# Altium project Timingcard_PROJECT_v10.PrjPcb (part 2 of 4)

## Sheet 05-GPS_IMU_SENSORS.SchDoc
size Tabloid; Customer: 01910; SPICEModelCache: <root> / <DocumentId>YSTRYKDD</DocumentId> / <CacheFrame Number="0"> / <Model Name="emk105bj105_v-f" Kind="CKT"> / <Text>* EMK105BJ105_V-F     SPICE MODEL  ( General Type ) / *-------------------------------------------------------------------------------------------------------- / * Model Generated by TAIYO YUDEN Corporation (http://www.ty-top.com) / * Version 1.0 / * TAIYO YUDEN Control No. 170508_130520 / * Copyright(c) 2012 TAIYO YUDEN CO.,LTD. All Rights Reserved. / *-------------------------------------------------------------------------------------------------------- / * / * Products Name : Multilayer Ceramic Capacitors / * / * Characteristics : / *     Capacitance : 1 uF , Rated Voltage : 16V , TCC : X5R / *     Case Size : 1.0 x 0.5 / 0.039 x 0.02 [mm/inch] , Thickness : 0.5 / 0.02 [mm/inch] / *     (Conditions: Temperature = 25 degC , DC Bias Current/Voltage = 0A / 0V) / * / * Frequency Range : 40Hz - 3GHz / * / * External Node Assignments : / * / *  1  o---| |---o  2 / * / *-------------------------------------------------------------------------------------------------------- / .SubCkt EMK105BJ105_V-F 1 2 / **************************** / C0 1 110 0.68309u / Cm 1 101 0.26053u / C1 101 102 0.94076u / Rc1 101 102 1.9029k / C2 102 103 0.66707u / Rc2 102 103 120.36 / C3 103 110 0.57203u / Rc3 103 110 2.1097 / C2m 1 301 0.1871u / C21 301 302 3.2494u / Rc21 301 302 1.1117k / C22 302 303 2.1014u / Rc22 302 303 1.484k / C23 303 304 2.1172u / Rc23 303 304 1.3876k / C24 304 305 0.75729u / Rc24 304 305 332.59 / C25 305 306 0.94401u / Rc25 305 306 249.09 / C26 306 307 0.34674u / Rc26 306 307 28.352 / C27 307 308 0.37158u / Rc27 307 308 19.989 / C28 308 309 0.17933u / Rc28 308 309 31.748 / C29 309 110 0.016445u / Rc29 309 110 1.0592 / Rp0 1 110 100Meg / L0 110 120 0.2216n / Lm 120 130 0.1509n / L1 120 121 0.12659n / RL1 121 130 0.85161 / L2 120 122 0.15996n / RL2 122 130 0.42469 / L3 120 123 7.9543n / RL3 123 130 0.54643m / CR 120 124 0.24334u / LR 124 125 0.090738n / RR 125 130 68.076m / CL 130 140 2.7354p / LL 130 140 0.10762n / RL 130 140 50.614 / Rs 140 2 7.5416m / **************************** / .ends EMK105BJ105_V-F</Text> / </Model> / </CacheFrame> / </root>; SheetNumber: 5; SheetTotal: 16
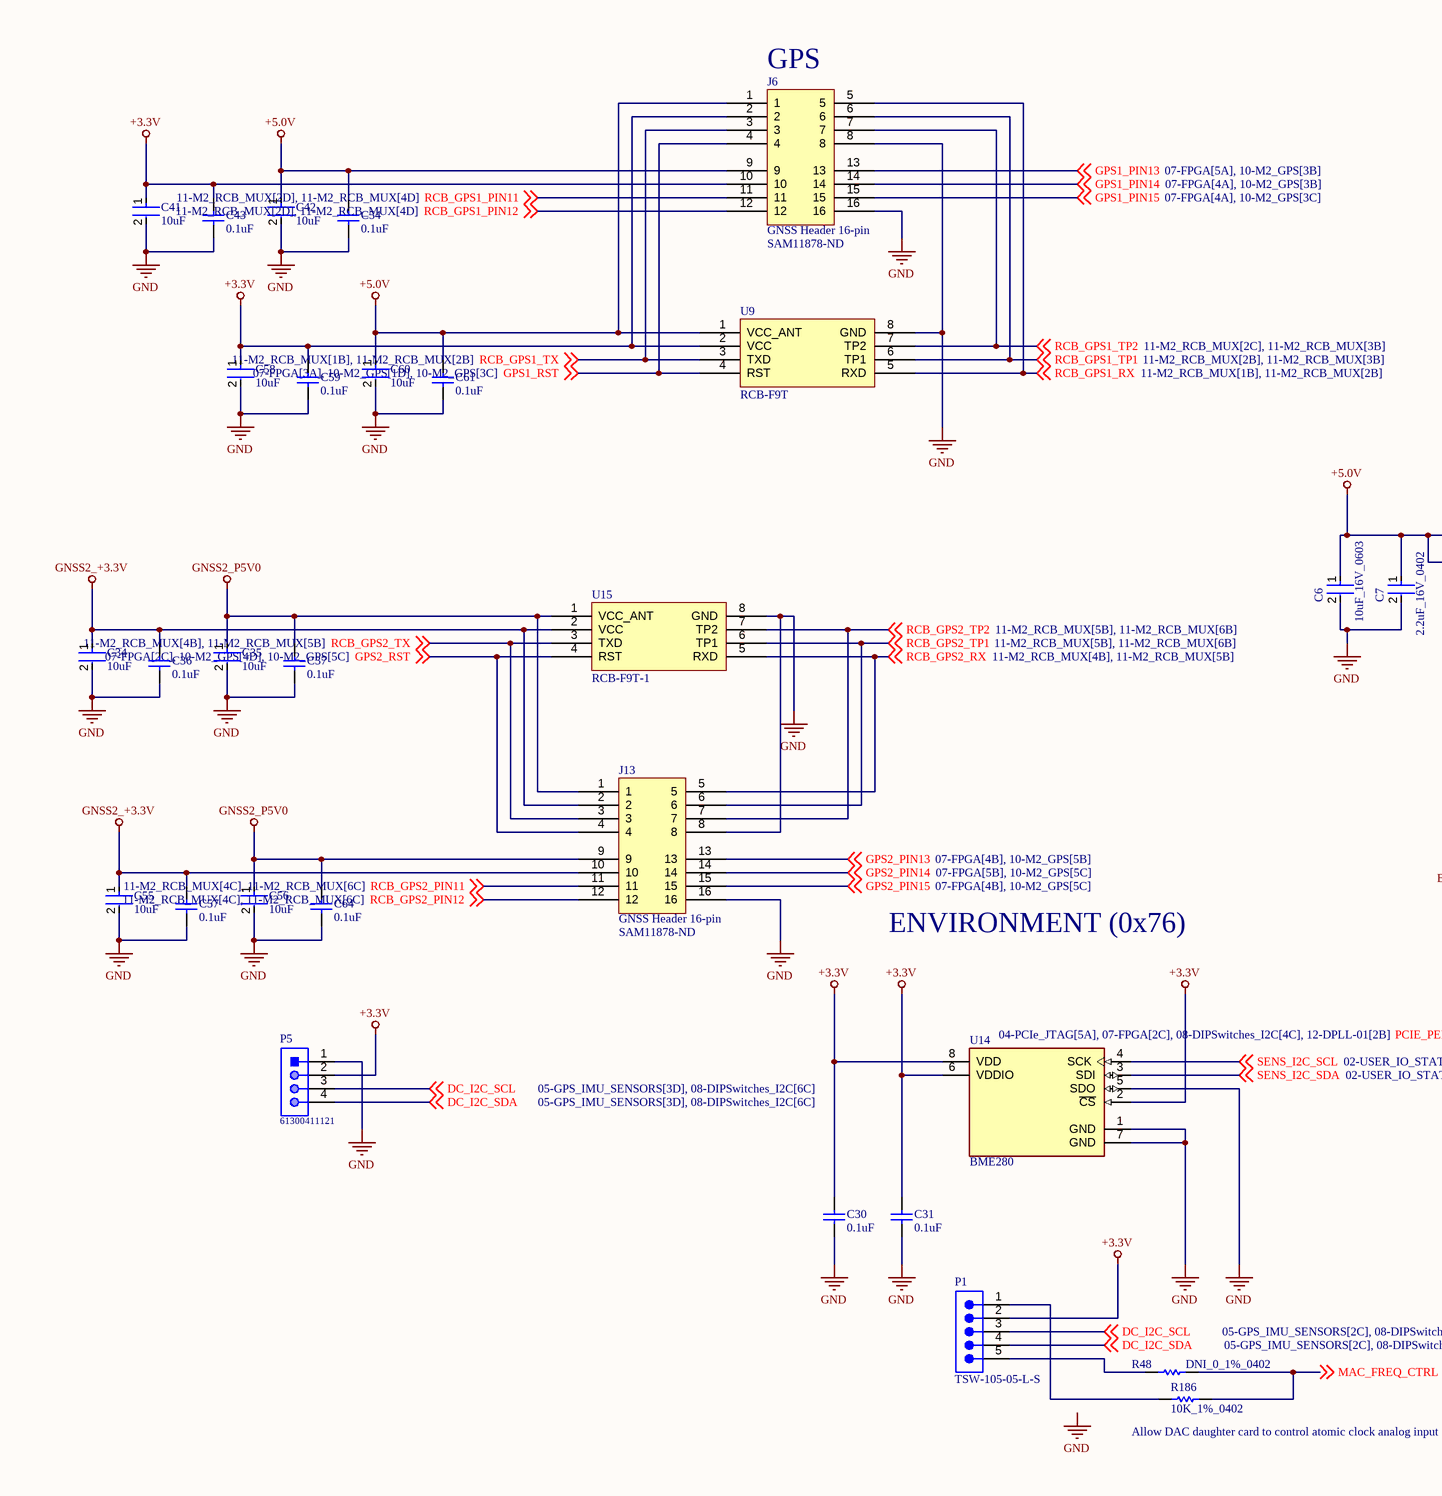
[diagram p4: 05-GPS_IMU_SENSORS.SchDoc, left]
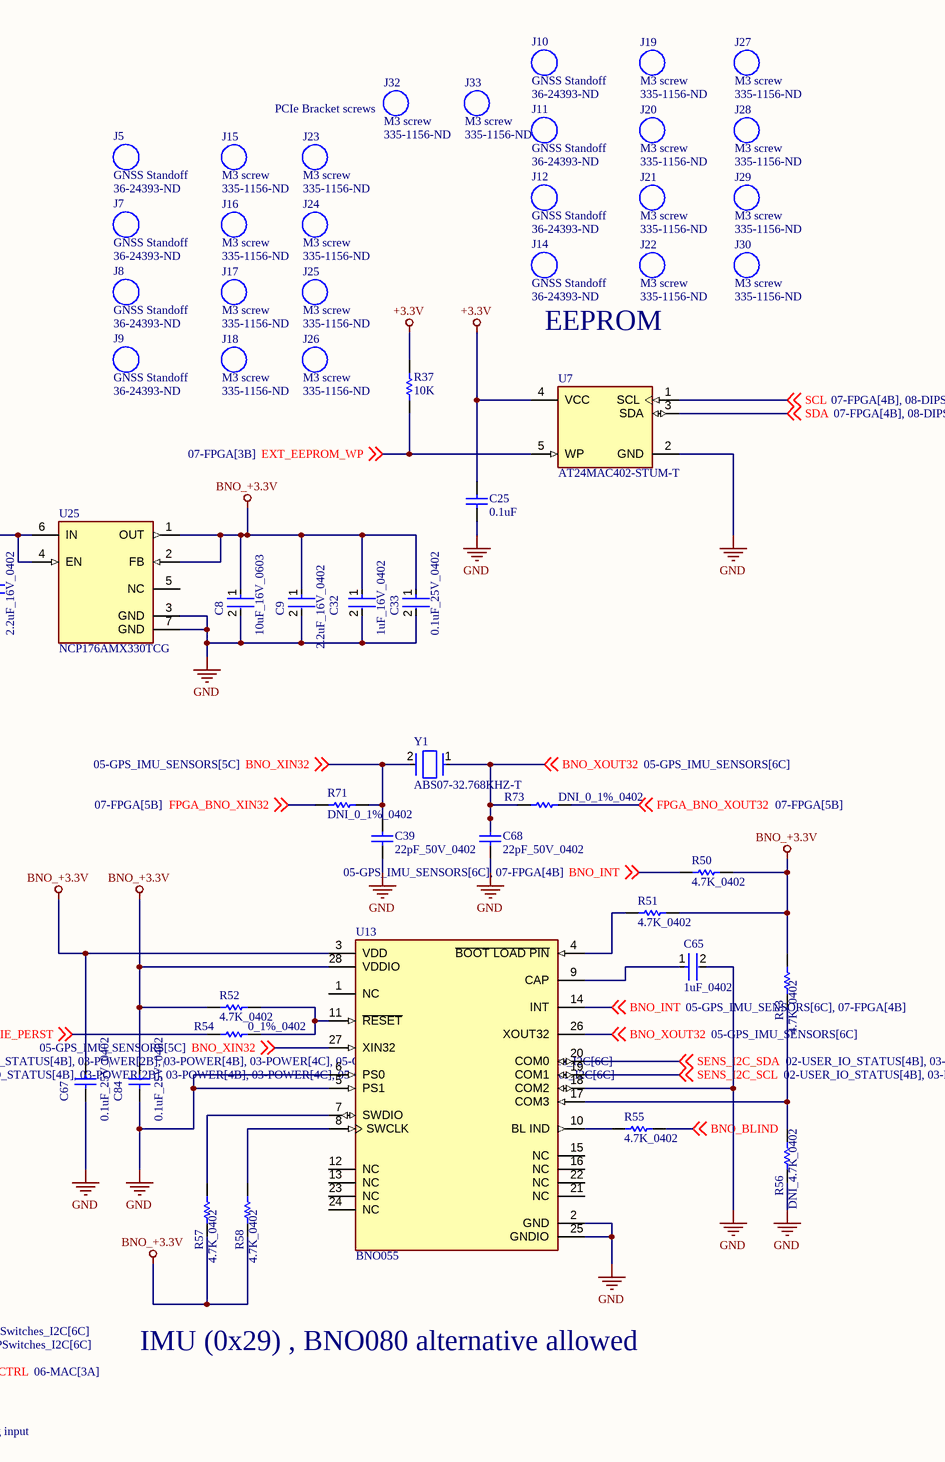
[diagram p5: 05-GPS_IMU_SENSORS.SchDoc, right]

### Parts
C6  10uF_16V_0603  [FP-0603-L_1_6_0_2-W_0_8_0-MFG]
C7  2.2uF_16V_0402  [FP-C1005-050-0_05-IPC_A]
C8  10uF_16V_0603  [FP-0603-L_1_6_0_2-W_0_8_0-MFG]
C9  2.2uF_16V_0402  [FP-C1005-050-0_05-IPC_A]
C25  0.1uF  [CAPC1608X87X45ML20T05]
C30  0.1uF  [CAPC1608X87X45ML20T05]
C31  0.1uF  [CAPC1608X87X45ML20T05]
C32  1uF_16V_0402  [FP-0402-L_1_0_0_05-W_0_5-IPC_A]
C33  0.1uF_25V_0402  [FP-0402-L_1_0_1-W_0_5_0_1-IPC_C]
C34  10uF  [FP-MK212BG-MFG]
C35  10uF  [FP-MK212BG-MFG]
C36  0.1uF  [CAPC1608X87X45ML20T05]
C37  0.1uF  [CAPC1608X87X45ML20T05]
C39  22pF_50V_0402  [CAPC1005X55X25ML05T05]
C41  10uF  [FP-MK212BG-MFG]
C42  10uF  [FP-MK212BG-MFG]
C43  0.1uF  [CAPC1608X87X45ML20T05]
C54  0.1uF  [CAPC1608X87X45ML20T05]
C55  10uF  [FP-MK212BG-MFG]
C56  10uF  [FP-MK212BG-MFG]
C57  0.1uF  [CAPC1608X87X45ML20T05]
C58  10uF  [FP-MK212BG-MFG]
C59  0.1uF  [CAPC1608X87X45ML20T05]
C60  10uF  [FP-MK212BG-MFG]
C61  0.1uF  [CAPC1608X87X45ML20T05]
C64  0.1uF  [CAPC1608X87X45ML20T05]
C65  1uF_0402  [FP-0402-L_1_0_0_05-W_0_5-IPC_C]
C67  0.1uF_25V_0402  [CAPC1005X56X25NL10T15]
C68  22pF_50V_0402  [CAPC1005X55X25ML05T05]
C84  0.1uF_25V_0402  [CAPC1005X56X25NL10T15]
J5  GNSS Standoff  Supplier Part Number 1: 36-24393-ND
J6  GNSS Header 16-pin  Supplier Part Number 1: SAM11878-ND  [GNSS Header 16-pin]
J7  GNSS Standoff  Supplier Part Number 1: 36-24393-ND
J8  GNSS Standoff  Supplier Part Number 1: 36-24393-ND
J9  GNSS Standoff  Supplier Part Number 1: 36-24393-ND
J10  GNSS Standoff  Supplier Part Number 1: 36-24393-ND
J11  GNSS Standoff  Supplier Part Number 1: 36-24393-ND
J12  GNSS Standoff  Supplier Part Number 1: 36-24393-ND
J13  GNSS Header 16-pin  Supplier Part Number 1: SAM11878-ND  [GNSS Header 16-pin]
J14  GNSS Standoff  Supplier Part Number 1: 36-24393-ND
J15  M3 screw  Supplier Part Number 1: 335-1156-ND
J16  M3 screw  Supplier Part Number 1: 335-1156-ND
J17  M3 screw  Supplier Part Number 1: 335-1156-ND
J18  M3 screw  Supplier Part Number 1: 335-1156-ND
J19  M3 screw  Supplier Part Number 1: 335-1156-ND
J20  M3 screw  Supplier Part Number 1: 335-1156-ND
J21  M3 screw  Supplier Part Number 1: 335-1156-ND
J22  M3 screw  Supplier Part Number 1: 335-1156-ND
J23  M3 screw  Supplier Part Number 1: 335-1156-ND
J24  M3 screw  Supplier Part Number 1: 335-1156-ND
J25  M3 screw  Supplier Part Number 1: 335-1156-ND
J26  M3 screw  Supplier Part Number 1: 335-1156-ND
J27  M3 screw  Supplier Part Number 1: 335-1156-ND
J28  M3 screw  Supplier Part Number 1: 335-1156-ND
J29  M3 screw  Supplier Part Number 1: 335-1156-ND
J30  M3 screw  Supplier Part Number 1: 335-1156-ND
J32  M3 screw  Supplier Part Number 1: 335-1156-ND
J33  M3 screw  Supplier Part Number 1: 335-1156-ND
P1  TSW-105-05-L-S  [SMTC-TSW-105-05-X-S]
P5  61300411121  [61300411121]
R37  10K  [RESC1608X55X30LL15T20]
R48  DNI_0_1%_0402  [RESC1005X40X25LL05T05]  (no BOM)
R50  4.7K_0402  [RESC1005X40X25LL05T05]
R51  4.7K_0402  [RESC1005X40X25LL05T05]
R52  4.7K_0402  [RESC1005X40X25LL05T05]
R53  4.7K_0402  [RESC1005X40X25LL05T05]
R54  0_1%_0402  [RESC1005X40X25LL05T05]
R55  4.7K_0402  [RESC1005X40X25LL05T05]
R56  DNI_4.7K_0402  [RESC1005X40X25LL05T05]  (no BOM)
R57  4.7K_0402  [RESC1005X40X25LL05T05]
R58  4.7K_0402  [RESC1005X40X25LL05T05]
R71  DNI_0_1%_0402  [RESC1005X40X25LL05T05]  (no BOM)
R73  DNI_0_1%_0402  [RESC1005X40X25LL05T05]  (no BOM)
R186  10K_1%_0402  [RESC1005X40X25LL05T10]
U7  AT24MAC402-STUM-T  [FP-5TS1-IPC_C]
U9  RCB-F9T  [GNSS]
U13  BNO055  [FP-BNO055-MFG]
U14  BME280  [FP-BME280-MFG]
U15  RCB-F9T-1  [GNSS]
U25  NCP176AMX330TCG  [FP-711AT-MFG]
Y1  ABS07-32.768KHZ-T  [FP-ABS07-MFG]

### Nets
+3.3V: C25.2 C30.2 C31.2 C41.1 C43.2 C58.1 C59.2 J6.2 J6.10 P1.2 P5.2 R37.2 U7.4(VCC) U9.2(VCC) U14.2(~{CS}) U14.6(VDDIO) U14.8(VDD)
+5.0V: C6.1 C7.1 C42.1 C54.2 C60.1 C61.2 J6.1 J6.9 U9.1(VCC_ANT) U25.4(EN) U25.6(IN)
BNO_+3.3V: C8.1 C9.1 C32.1 C33.1 C67.2 C84.2 R50.1 R51.1 R52.2 R53.2 R57.1 R58.1 U13.3(VDD) U13.28(VDDIO) U25.1(OUT) U25.2(FB)
GND: C6.2 C7.2 C8.2 C9.2 C25.1 C30.1 C31.1 C32.2 C33.2 C34.2 C35.2 C36.1 C37.1 C39.1 C41.2 C42.2 C43.1 C54.1 C55.2 C56.2 C57.1 C58.2 C59.1 C60.2 C61.1 C64.1 C65.2 C67.1 C68.1 C84.1 J6.8 J6.16 J13.8 J13.16 P5.1 R56.1 U7.2(GND) U9.8(GND) U13.2(GND) U13.5(PS1) U13.6(PS0) U13.18(COM2) U13.25(GNDIO) U14.1(GND) U14.5(SDO) U14.7(GND) U15.8(GND) U25.3(GND) U25.7(GND)
GNSS2_+3.3V: C34.1 C36.2 C55.1 C57.2 J13.2 J13.10 U15.2(VCC)
GNSS2_P5V0: C35.1 C37.2 C56.1 C64.2 J13.1 J13.9 U15.1(VCC_ANT)
BNO_BLIND: R55.1 ; off-sheet BNO_BLIND
BNO_INT: R50.2 U13.14(INT) ; off-sheet BNO_INT
BNO_XIN32: C39.2 R71.1 U13.27(XIN32) Y1.2 ; off-sheet BNO_XIN32
BNO_XOUT32: C68.2 R73.1 U13.26(XOUT32) Y1.1 ; off-sheet BNO_XOUT32
DC_I2C_SCL: P1.3 P5.3 ; off-sheet DC_I2C_SCL
DC_I2C_SDA: P1.4 P5.4 ; off-sheet DC_I2C_SDA
EXT_EEPROM_WP: R37.1 U7.5(WP) ; off-sheet EXT_EEPROM_WP
FPGA_BNO_XIN32: R71.2 ; off-sheet FPGA_BNO_XIN32
FPGA_BNO_XOUT32: R73.2 ; off-sheet FPGA_BNO_XOUT32
GPS1_PIN13: J6.13 ; off-sheet GPS1_PIN13
GPS1_PIN14: J6.14 ; off-sheet GPS1_PIN14
GPS1_PIN15: J6.15 ; off-sheet GPS1_PIN15
GPS1_RST: J6.4 U9.4(RST) ; off-sheet GPS1_RST
GPS2_PIN13: J13.13 ; off-sheet GPS2_PIN13
GPS2_PIN14: J13.14 ; off-sheet GPS2_PIN14
GPS2_PIN15: J13.15 ; off-sheet GPS2_PIN15
GPS2_RST: J13.4 U15.4(RST) ; off-sheet GPS2_RST
MAC_FREQ_CTRL: R48.2 R186.2 ; off-sheet MAC_FREQ_CTRL
PCIE_PERST: R54.1 ; off-sheet PCIE_PERST
RCB_GPS1_PIN11: J6.11 ; off-sheet RCB_GPS1_PIN11
RCB_GPS1_PIN12: J6.12 ; off-sheet RCB_GPS1_PIN12
RCB_GPS1_RX: J6.5 U9.5(RXD) ; off-sheet RCB_GPS1_RX
RCB_GPS1_TP1: J6.6 U9.6(TP1) ; off-sheet RCB_GPS1_TP1
RCB_GPS1_TP2: J6.7 U9.7(TP2) ; off-sheet RCB_GPS1_TP2
RCB_GPS1_TX: J6.3 U9.3(TXD) ; off-sheet RCB_GPS1_TX
RCB_GPS2_PIN11: J13.11 ; off-sheet RCB_GPS2_PIN11
RCB_GPS2_PIN12: J13.12 ; off-sheet RCB_GPS2_PIN12
RCB_GPS2_RX: J13.5 U15.5(RXD) ; off-sheet RCB_GPS2_RX
RCB_GPS2_TP1: J13.6 U15.6(TP1) ; off-sheet RCB_GPS2_TP1
RCB_GPS2_TP2: J13.7 U15.7(TP2) ; off-sheet RCB_GPS2_TP2
RCB_GPS2_TX: J13.3 U15.3(TXD) ; off-sheet RCB_GPS2_TX
SCL: U7.1(SCL) ; off-sheet SCL
SDA: U7.3(SDA) ; off-sheet SDA
SENS_I2C_SCL: U13.19(COM1) U14.4(SCK) ; off-sheet SENS_I2C_SCL
SENS_I2C_SDA: U13.20(COM0) U14.3(SDI) ; off-sheet SENS_I2C_SDA
NetC65_1: C65.1 U13.9(CAP)
NetP1_1: P1.1 R186.1
NetP1_5: P1.5 R48.1
NetR51_2: R51.2 U13.4(~{BOOT_LOAD_PIN})
NetR52_1: R52.1 R54.2 U13.11(~{RESET})
NetR53_1: R53.1 R56.2 U13.17(COM3)
NetR55_2: R55.2 U13.10(BL_IND)
NetR57_2: R57.2 U13.7(SWDIO)
NetR58_2: R58.2 U13.8(SWCLK)

Not connected (* = marked no-connect by the designer): U13 1(NC) 12(NC) 13(NC) 15(NC) 16(NC) 21(NC) 22(NC) 23(NC) 24(NC); U25 5(NC)

### Notes on the sheet
- (near J6) GPS
- (near J32) PCIe Bracket screws
- EEPROM
- ENVIRONMENT (0x76)
- IMU (0x29) , BNO080 alternative allowed
- (near R186) Allow DAC daughter card to control atomic clock analog input
- Labels drawn without touching a wire or pin: GND
- SHEET
- REV
- timingcard.com <http://timingcard.com>
- DATE
- OF

### Library data of the parts
C6 C8 = CMP-2000-06226-4: Multilayer Ceramic Capacitor 10uF 16V X5R 20% SMD 0603 T/R; Packaging: Tape and Reel; Construction: Flat; Height: 0.8mm; Max Operating Temperature: 85°C; Dielectric: X5R; Case Code (Metric): 1608; Voltage Rating (DC): 16V; Width: 0.031inch; Voltage Rating: 16V; Length: 0.063inch; RoHS Compliant: Yes; Halogen Free: Halogen Free; Case Code (Imperial): 0603; Capacitance: 10uF; Mount: Surface Mount; Thickness: 0.031inch; Tolerance: 20%; Min Operating Temperature: -55°C; Series: M; Termination: SMD/SMT; Case/Package: 0603; Package Quantity: 1
C7 C9 = CMP-2000-05998-2: Multilayer Ceramic Capacitors 2.2μF ±10% 16V X5R SMD 0402; Capacitance: 2.2uF; REACH SVHC: No SVHC; Series: C; Termination: SMD/SMT; Case Code (Imperial): 0402; Depth: 0.5mm; Mount: Surface Mount; Width: 0.02inch; Package Quantity: 1; Dielectric Material: Ceramic; Length: 1mm; Packaging: Tape and Reel; Case Code (Metric): 1005; RoHS Compliant: Yes; Dielectric: X5R; Max Operating Temperature: 85°C; Lead Free: Lead Free; Weight: 2.3E-05oz; Thickness: 0.022inch; Voltage Rating (DC): 16V; Tolerance: 10%; Voltage Rating: 16V; Resistor Type: Ceramic; Height: 0.5mm; Case/Package: 0402; Min Operating Temperature: -55°C
C25 C30 C31 C36 C37 C43 C54 C57 C59 C61 C64 = CMP-2006-00003-1: C0603X104K5RACAUTO; Manufacturer: Kemet; Part Number: C0603X104K5RACAUTO
C32 = CMP-14477-000104-2: None; Tolerance: 10%; Voltage Rating: 16V; Dielectric: X5R; Capacitance: 1uF; Packaging: Tape and Reel; Depth: 0.5mm; Mount: Surface Mount; Thickness: 0.022inch; Package Quantity: 1; Min Operating Temperature: -55°C; Series: M; Voltage Rating (DC): 16V; Termination: SMD/SMT; Case/Package: 0402; Number of Pins: 2; Case Code (Imperial): 0402; Length: 1mm; Halogen Free: Halogen Free; Case Code (Metric): 1005; Width: 0.02inch; RoHS Compliant: Yes; Radiation Hardening: No; Max Operating Temperature: 85°C; Height: 0.5mm; Construction: Flat
C33 = CMP-2008-02519-2: as C26 on sheet 01-USER_IO; Package Quantity: 1; Capacitance: 100nF; Min Operating Temperature: -55°C; Voltage: 25V; Voltage Rating: 25V; Construction: Flat; Max Operating Temperature: 125°C; Radiation Hardening: No; Depth: 0.5mm; Thickness: 0.022inch; Voltage Rating (DC): 25V; Number of Pins: 2; Lead Free: Lead Free; Series: -; REACH SVHC: No SVHC; Length: 1mm; Dielectric: X7R; RoHS Compliant: Yes; Mount: Surface Mount; Packaging: Tape and Reel; Case/Package: 0402; Case Code (Imperial): 0402; Termination: SMD/SMT; Width: 0.02inch; Case Code (Metric): 1005; Tolerance: 10%
C34 C35 C41 C42 C55 C56 C58 C60 = CMP-14477-000079-2: None; Voltage Rating (DC): 25V; Tolerance: 10%; Dielectric: X7R; Voltage: 16V; Packaging: Tape and Reel; Capacitance: 10uF; Thickness: 0.053inch; Resistor Type: Ceramic; RoHS Compliant: Yes; Lead Free: Lead Free; REACH SVHC: No SVHC; Number of Pins: 2; Package Quantity: 1; Mount: Surface Mount; Termination: SMD/SMT; Width: 0.049inch; Max Operating Temperature: 85°C; Length: 0.079inch; Case/Package: 0805; Voltage Rating: 25V; Min Operating Temperature: -55°C; Case Code (Metric): 2012; Case Code (Imperial): 0805; Height: 1.25mm; Series: M
C39 C68 = CMP-2100-03590-1: Chip Capacitor, 22 pF, +/- 5%, 50 V, -55 to 125 degC, 0402 (1005 Metric), RoHS, Tape and Reel; Manufacturer: Yageo; Voltage Rating: 50V; Dielectric Material: Ceramic; Capacitance: 22pF; Temperature Coefficient: 30ppm/degC; Dielectric: C0G; Insulation Resistance: 100GR; Datasheet URL: http://www.yageo.com/NewPortal/yageodocoutput?fileName=/pdf/MLCC/UPY-GP_NP0_16V-to-50V_14.pdf; Depth: 0.5mm; Number of Pins: 2; Height: 0.5mm; Min Operating Temperature: -55degC; REACH SVHC: NoSVHC; Max Operating Temperature: 125degC; Voltage Rating (DC): 50V; Composition: Ceramic; Packaging: TapeandReel; Package Quantity: 1; Package Reference: 0402; Length: 1mm; Radiation Hardening: No; Package Description: 2-Pin Surface Mount Device, Body 1 x 0.5 mm; RoHSCompliant: True; Thickness: 0.022inch; Manufacturer URL: http://www.yageo.com/; Mount: SurfaceMount; Case Code (Metric): 1005; Case/Package: 0402; Tolerance: 5%; Termination: SMD/SMT; Width: 0.02inch; Datasheet Version: Rev. 14, 07/2016; Lead Free: LeadFree; Case Code (Imperial): 0402
C65 = CMP-14477-003537-2: None; Tolerance: 20%; Voltage Rating (DC): 16V; Capacitance: 1uF; Dielectric: X5R; Height: 0.5mm; Package Quantity: 10000; Series: M; Max Operating Temperature: 85°C; Width: 0.02inch; Mount: Surface Mount; Thickness: 0.022inch; Length: 1mm; Min Operating Temperature: -55°C; Depth: 0.5mm; RoHS Compliant: Yes; Construction: Flat; Case/Package: 0402; Radiation Hardening: No; Packaging: Tape and Reel; Voltage: 16V; Voltage Rating: 16V; Halogen Free: Halogen Free
C67 C84 = CMP-1034-02072-2: Part Number: 04023D104KAT2A; Manufacturer: AVX Interconnect / Elco
P1 = CMP-1024-00366-1: 0.025" SQ Post Header, Through-hole, Vertical, -55 to 125 degC, 2.54 mm Pitch, 5-Pin, Male, RoHS; Manufacturer: Samtec; Pitch: 2.54 mm; PackageVersion: DM, 8/1988; PartNumber: TSW-105-05-L-S; Orientation: Vertical; Temperature Range: -55 to 125 degC; ComponentLink1Description: Manufacturer URL; PackageDescription: .025[0.64] SQ. Post Terminal Strip Assembly; ComponentLink2URL: http://www.samtec.com/documents/webfiles/pdf/TSW_TH.PDF; PackageReference: TSW-105-05-X-S; ComponentLink2Description: Datasheet; Mounting Technology: Through-hole; DatasheetVersion: F-214; ComponentLink1URL: http://www.samtec.com; RoHS: True; ComponentLink3URL: http://www.samtec.com/documents/webfiles/cpdf/TSW-XXX-XX-XXX-X-XX-XXX-MKT.pdf; ComponentLink3Description: Package Specification
P5 = CMP-1502-01064-1: THT Vertical Pin Header WR-PHD, Pitch 2.54 mm, Single Row, 4 pins; Manufacturer: Wurth Elektronik; Withstanding Voltage: 500VAC; Rated Current: 3A; Working Voltage: 250VAC; Pin Number: 4; Gender: Male; Contact Resistance: 20mOhm; Pitch: 2.54mm; Manufacturer URL: http://www.we-online.de; Operating Temperature: -40to105degC; Packaging: Bag; Mounting Technology: THT; Package Reference: 61300411121; Datasheet URL: https://katalog.we-online.de/em/datasheet/6130xx11121.pdf; Publisher: WurthElektronik; Part Number: 61300411121; Row Number: Single; Orientation: Vertical
R37 = CMP-2000-06990-1: Chip Resistor, 10 KOhm, +/- 1%, 0.1 W, -55 to 155 degC, 0603 (1608 Metric), RoHS, Tape and Reel RMCF0603FT10K0; Manufacturer: Stackpole-Electronics-Inc.; Temperature Coefficient: ±100ppm/°C; Power (Watts): 0.1W,1/10W; Package / Case: 0603(1608Metric); Datasheet Version: 01/2017; Resistance (Ohms): 10k; Features: AutomotiveAEC-Q200; Packaging: CutTape(CT); Series: RMCF; Height: 0.022"(0.55mm); Tolerance: ±1%; Manufacturer URL: https://www.seielect.com/; Datasheet URL: https://www.seielect.com/Catalog/SEI-RMCF_RMCP.pdf; Supplier Device Package: 0603; Number of Terminations: 2; Family: ChipResistor-SurfaceMount; Package Reference: 0603; Size / Dimension: 0.061"Lx0.031"W(1.55mmx0.80mm); Mounting Technology: SurfaceMount; Package Description: 2-Pin Surface Mount Device, Body 1.55 x 0.8 mm; Operating Temperature: -55°C~155°C; Composition: ThickFilm; Category: Resistors
R48 R54 R71 R73 = CMP-2000-07451-1: Chip Resistor, 0 Ohm, 0.1 W, -55 to 155 degC, 0402 (1005 Metric), RoHS, Tape and Reel; Manufacturer: Panasonic; Voltage Rating (DC): 50V; Temperature Coefficient: 600ppm/��C; Max Power Dissipation: 100mW; Resistance: 0mOhm; Tolerance: 5%; Number of Terminations: 2; Mount: SurfaceMount; Height: 0.35mm; Packaging: TapeandReel; Contact Plating: Tin; Manufacturer URL: http://www.panasonic.com/; Composition: ThickFilm; Max Operating Temperature: 155degC; REACH SVHC: NoSVHC; Case/Package: 0402; Package Reference: 402; Depth: 0.5mm; Package Description: 2-Pin Surface Mount Device, Body 1 x 0.5 mm; Datasheet URL: https://industrial.panasonic.com/cdbs/www-data/pdf/RDA0000/AOA0000C301.pdf; RoHSCompliant: True; Case Code (Imperial): 0402; Military Standard: Not; Min Operating Temperature: -55degC; Power Rating: 100mW; Datasheet Version: 03/2015; Length: 1mm; Case Code (Metric): 1005; Termination: SMD/SMT; Mounting Technology: SurfaceMount; Voltage Rating: 50V; Width: 0.02inch; Package Quantity: 1; Lead Free: LeadFree; Radiation Hardening: No
R50-R53 R55-R58 = CMP-2002-01154-4: Chip Resistor, 4.7 KOhm, +/- 1%, 0.1 W, -55 to 155 degC, 0402 (1005 Metric), RoHS, Tape and Reel; PartNumber: ERJ-2RKF4701X; Voltage Rating: 50 V; Case\/Package: 0402; Power Rating: 100 mW; Height: 0.35 mm; Mounting Technology: Surface Mount; REACH SVHC: Yes; Resistance: 4.7 KOhm; Max Operating Temperature: 155 degC; ComponentLink1Description: Manufacturer URL; ComponentLink2Description: Datasheet; Pins: 2; PackageReference: 0402; Tolerance: 1%; Case Code (Imperial): 0402; Length: 1 mm; PackageDescription: 2-Pin Surface Mount Device, Body 1 x 0.5 mm; RoHSCompliant: true; Package Quantity: 1; Radiation Hardening: No; DatasheetVersion: 04/2015; Width: 0.5 mm; Case Code (Metric): 1005; Mount: Surface Mount; ComponentLink1URL: http://www.panasonic.com/; Min Operating Temperature: -55 degC; Packaging: Cut Tape; ComponentLink2URL: http://industrial.panasonic.com/cdbs/www-data/pdf/RDA0000/AOA0000C86.pdf
R186 = CMP-2002-07353-1: Part Number: RC0402FR-0710KL; Manufacturer: Yageo / Phycomp
U7 = CMP-06313-000011-1: IC EEPROM 2K I2C 1MHZ SOT23-5; Manufacturer: Microchip; Memory Size: 2Kbits; Min Supply Voltage: 1.7V; Max Supply Voltage: 5.5V; Frequency: 1000kHz; Standoff Height: 0mm; Nominal Supply Current: 0.4-2mA; Access Time: 0.55us; Interface: I2C,2-Wire; Temperature Range Low: -40°C; Height: 1mm; ComponentLink2URL: http://ww1.microchip.com/downloads/en/DeviceDoc/Atmel-8807-SEEPROM-AT24MAC402-602-Datasheet.pdf; Ipc Land Pattern Name: SOT95P280X100-5; Category: IC; Memory Type: EEPROM; Digikey Description: IC EEPROM 2K I2C 1MHZ SOT23-5; Manufacturer Part Number: AT24MAC402-STUM-T; Device Class L1: Integrated Circuits (ICs); Temperature Range High: +85°C; ComponentLink2Description: Datasheet; RoHS: TRUE; Mouser Description: EEPROM Serial-I2C 2K-bit 256 x 8 1.8V/2.5V/3.3V/5V 5-Pin SOT-23 T/R; Octopart: https://octopart.com/at24mac402-stum-t-microchip-77758112; Temperature: -40°C to +85°C; Package: 5TS1; Device Class L3: EEPROM; Automotive: No; Device Class L2: Memory; Lead Free: Yes
U9 U15 = RCB-F9T: MOD, GPS; VELENTIUM PART NUM: <V PART NUM>; MFG NAME: UBLOCKS; MINTEMP: -40C; MAXTEMP: 80C; DESC: MOD BLE 4.2; CATEGORY: MOD; MODIFY DATE: 9/11/13; P1: GPS; SHEETPART: *; DATE: .; Supplier 1: Digi-Key; Supplier Part Number 1: 672-RCB-F9T-ND
  U9: MFG PART NUM: RCB-F9T
  U15: MFG PART NUM: RCB-F9T-1
U13 = CMP-2000-05075-4: IMU ACCEL/GYRO/MAG I2C 28LGA; Sensor Type: Accelerometer; Packaging: Tape and Reel; Case/Package: LGA; Min Operating Temperature: -40°C; Mount: Surface Mount; Output Type: I2C; Lead Free: Lead Free; Max Operating Temperature: 85°C
U14 = CMP-2000-05073-3: SENSOR PRESSURE HUMIDITY TEMP; Sensor Type: Temperature; Accuracy: 3%; Response Time: 1s; Output Type: SPI; Min Operating Temperature: -40°C; Max Operating Temperature: 85°C; Case/Package: LGA; Packaging: Cut Tape; Mount: Surface Mount; Lead Free: Lead Free; Number of Pins: 8
U25 = CMP-07128-000022-1: IC REG LINEAR 3.3V 500MA 6XDFN; Manufacturer: ON Semiconductor; Output Type: Fixed; Dropout Voltage: 295mV; Number Of Outputs: 1; Standoff Height: 0mm; Min Supply Voltage: 1.4V; Nominal Supply Current: 60uA; Max Supply Voltage: 5.5V; Max Junction Temp: +150°C; Accuracy Percentage: 0.8%; Footprint Url: https://www.onsemi.com/pub/Collateral/711AT.PDF; Device Class L2: Power Management ICs; Device Class L1: Integrated Circuits (ICs); Digikey Description: IC REG LINEAR 3.3V 500MA 6XDFN; ComponentLink2Description: Datasheet; Output Voltage: 3.3V; ComponentLink2URL: https://www.onsemi.com/pub/Collateral/NCP176-D.PDF; RoHS: TRUE; Lead Free: Yes; Output Current: 500mA; Automotive: No; Temperature Range High: +150°C; Height: 0.45mm; Package: 711AT; Device Class L3: Voltage Regulators - Linear; Octopart: https://octopart.com/ncp176amx330tcg-on+semiconductor-61522616; Category: IC; Manufacturer Part Number: NCP176AMX330TCG; Ipc Land Pattern Name: DFN120X120X37-6; Temperature: to +150°C
Y1 = CMP-0447-00001-4: Crystal 32.768kHz ±20ppm (Tol) 12.5pF FUND 70kΩ 2-Pin CSMD T/R; ESR (Equivalent Series Resistance): 70kR; Radiation Hardening: No; Frequency: 32.768kHz; Length: 3.2mm; Max Operating Temperature: 85°C; Number of Pins: 2; Series: ABS07; Min Operating Temperature: -40°C; Frequency Tolerance: 20ppm; Packaging: Tape and Reel; Height: 0.9mm; Width: 1.5mm; Depth: 1.5mm; Load Capacitance: 12.5pF; RoHS Compliant: Yes; Tolerance: 20ppm; Termination: SMD/SMT; Lead Free: Lead Free; Series Resistance: 70kR; REACH SVHC: No SVHC; Case/Package: CSMD; Operating Frequency: 32.768 kHz; Package Quantity: 3000
J5 J7-J12 J14 = GNSS Standoff: Supplier 1: Digi-Key
J6 J13 = GNSS Header 16-pin: Supplier 1: Digi-Key
J15-J30 J32 J33 = M3 screw: Supplier 1: Digi-Key

## Sheet 06-MAC.SchDoc
size Tabloid; Customer: 01910; SheetNumber: 6; SheetTotal: 16
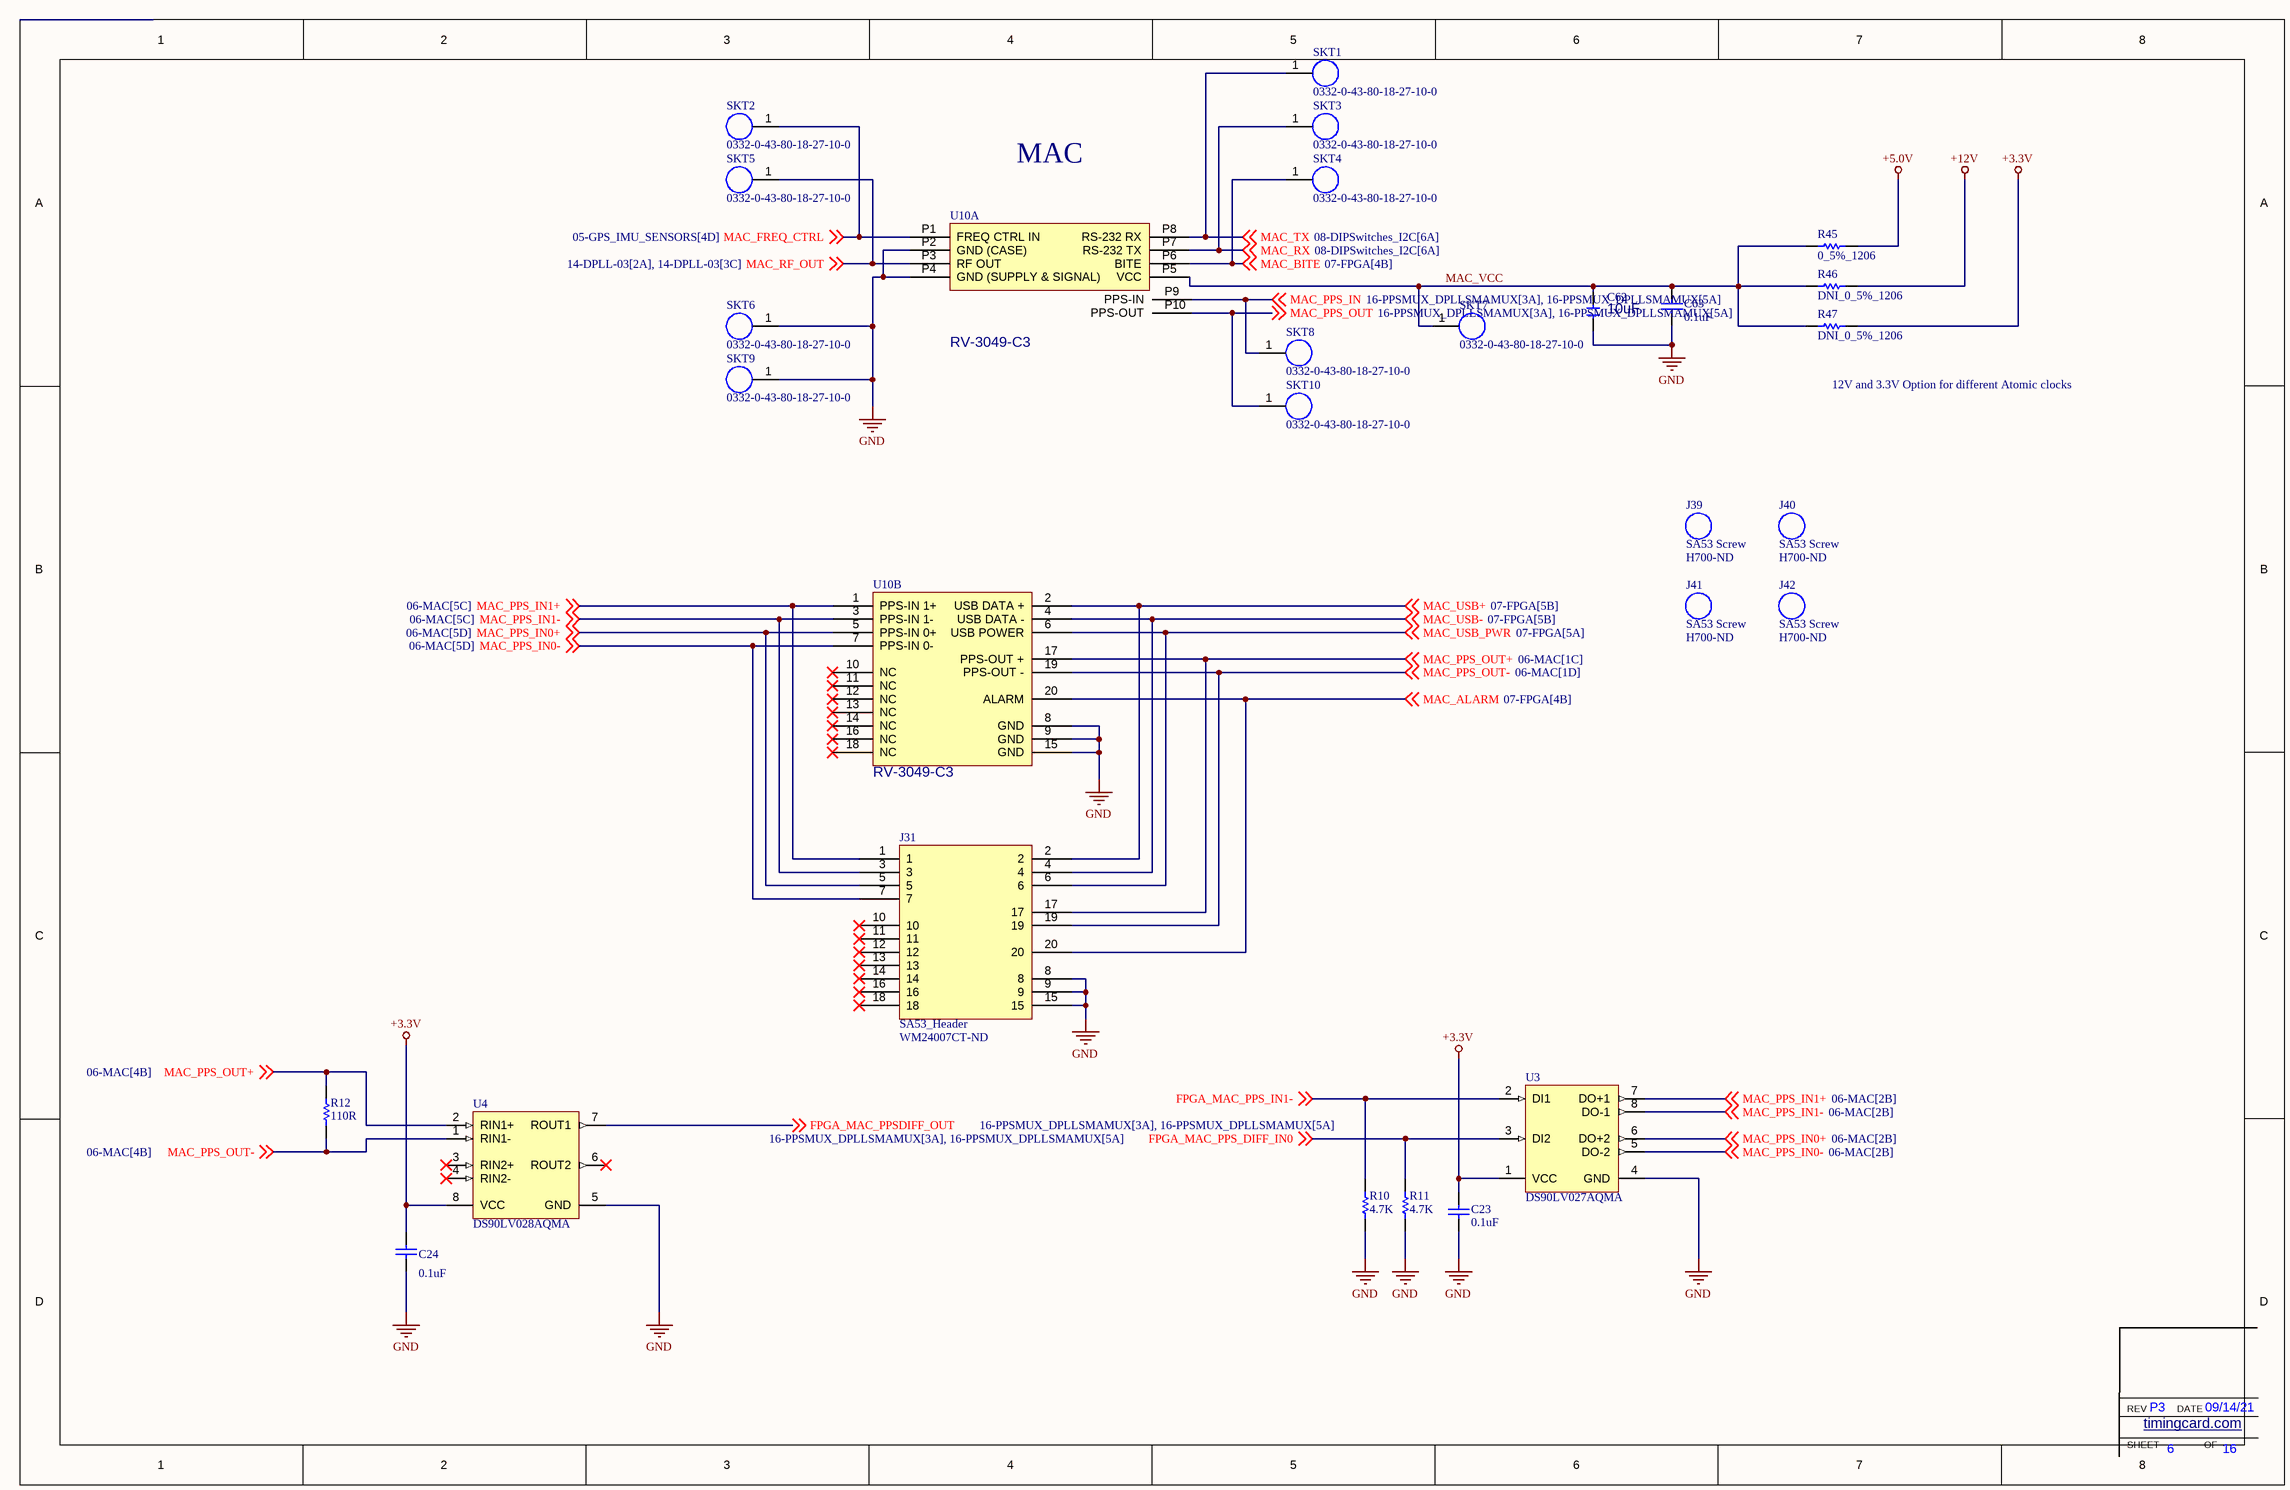
[diagram p6: 06-MAC.SchDoc]

### Parts
C23  0.1uF  [CAPC1608X87X45ML20T05]
C24  0.1uF  [CAPC1608X87X45ML20T05]
C62  value 10uF  [CAPC2012X14N]  (hidden comment: CAP_0805_10UF_25V)
C63  0.1uF  [CAPC1608X87X45ML20T05]
J31  SA53_Header  Supplier Part Number 1: WM24007CT-ND  [SA53_Header]
J39  SA53 Screw  Supplier Part Number 1: H700-ND
J40  SA53 Screw  Supplier Part Number 1: H700-ND
J41  SA53 Screw  Supplier Part Number 1: H700-ND
J42  SA53 Screw  Supplier Part Number 1: H700-ND
R10  4.7K  [RESC1608X55X25LL10T15]
R11  4.7K  [RESC1608X55X25LL10T15]
R12  110R  [RESC1609X50X30NL10T20]
R45  0_5%_1206  [RESC3116X65X50ML20T20]
R46  DNI_0_5%_1206  [RESC3116X65X50ML20T20]  (no BOM)
R47  DNI_0_5%_1206  [RESC3116X65X50ML20T20]  (no BOM)
SKT1  0332-0-43-80-18-27-10-0  [SolderSocket]
SKT2  0332-0-43-80-18-27-10-0  [SolderSocket]
SKT3  0332-0-43-80-18-27-10-0  [SolderSocket]
SKT4  0332-0-43-80-18-27-10-0  [SolderSocket]
SKT5  0332-0-43-80-18-27-10-0  [SolderSocket]
SKT6  0332-0-43-80-18-27-10-0  [SolderSocket]
SKT7  0332-0-43-80-18-27-10-0  [SolderSocket]
SKT8  0332-0-43-80-18-27-10-0  [SolderSocket]
SKT9  0332-0-43-80-18-27-10-0  [SolderSocket]
SKT10  0332-0-43-80-18-27-10-0  [SolderSocket]
U3  DS90LV027AQMA  [M08A_N]
U4  DS90LV028AQMA  [M08A_L]
U10  value RV-3049-C3  [SA53]  (hidden comment: MAC-SA5X)  (parts A,B of 2)

### Nets
+3.3V: C23.2 C24.1 R47.2 U3.1(VCC) U4.8(VCC)
+5.0V: R45.2
+12V: R46.2
GND: C23.1 C24.2 C62.2 C63.1 J31.8 J31.9 J31.15 R10.1 R11.1 SKT6.1 SKT9.1 U3.4(GND) U4.5(GND) U10.8(GND) U10.9(GND) U10.15(GND) U10.P2(GND_(CASE)) U10.P4(GND_(SUPPLY_&_SIGNAL))
FPGA_MAC_PPS_DIFF_IN0: R11.2 U3.3(DI2) ; off-sheet FPGA_MAC_PPS_DIFF_IN0
FPGA_MAC_PPS_IN1-: R10.2 U3.2(DI1) ; off-sheet FPGA_MAC_PPS_IN1-
FPGA_MAC_PPSDIFF_OUT: U4.7(ROUT1) ; off-sheet FPGA_MAC_PPSDIFF_OUT
MAC_ALARM: J31.20 U10.20(ALARM) ; off-sheet MAC_ALARM
MAC_BITE: SKT4.1 U10.P6(BITE) ; off-sheet MAC_BITE
MAC_FREQ_CTRL: SKT2.1 U10.P1(FREQ_CTRL_IN) ; off-sheet MAC_FREQ_CTRL
MAC_PPS_IN: SKT8.1 U10.P9(PPS-IN) ; off-sheet MAC_PPS_IN
MAC_PPS_IN0+: J31.5 U3.6(DO+2) U10.5(PPS-IN_0+) ; off-sheet MAC_PPS_IN0+
MAC_PPS_IN0-: J31.7 U3.5(DO-2) U10.7(PPS-IN_0-) ; off-sheet MAC_PPS_IN0-
MAC_PPS_IN1+: J31.1 U3.7(DO+1) U10.1(PPS-IN_1+) ; off-sheet MAC_PPS_IN1+
MAC_PPS_IN1-: J31.3 U3.8(DO-1) U10.3(PPS-IN_1-) ; off-sheet MAC_PPS_IN1-
MAC_PPS_OUT: SKT10.1 U10.P10(PPS-OUT) ; off-sheet MAC_PPS_OUT
MAC_PPS_OUT+: J31.17 R12.2 U4.2(RIN1+) U10.17(PPS-OUT_+) ; off-sheet MAC_PPS_OUT+
MAC_PPS_OUT-: J31.19 R12.1 U4.1(RIN1-) U10.19(PPS-OUT_-) ; off-sheet MAC_PPS_OUT-
MAC_RF_OUT: SKT5.1 U10.P3(RF_OUT) ; off-sheet MAC_RF_OUT
MAC_RX: SKT3.1 U10.P7(RS-232_TX) ; off-sheet MAC_RX
MAC_TX: SKT1.1 U10.P8(RS-232_RX) ; off-sheet MAC_TX
MAC_USB+: J31.2 U10.2(USB_DATA_+) ; off-sheet MAC_USB+
MAC_USB-: J31.4 U10.4(USB_DATA_-) ; off-sheet MAC_USB-
MAC_USB_PWR: J31.6 U10.6(USB_POWER) ; off-sheet MAC_USB_PWR
MAC_VCC: C62.1 C63.2 R45.1 R46.1 R47.1 SKT7.1 U10.P5(VCC)

Not connected (* = marked no-connect by the designer): J31 10* 11* 12* 13* 14* 16* 18*; U4 3(RIN2+)* 4(RIN2-)* 6(ROUT2)*; U10 10(NC)* 11(NC)* 12(NC)* 13(NC)* 14(NC)* 16(NC)* 18(NC)*

### Notes on the sheet
- MAC
- 12V and 3.3V Option for different Atomic clocks
- SHEET
- REV
- timingcard.com <http://timingcard.com>
- DATE
- OF

### Library data of the parts
C23 C24 C63 = CMP-2006-00003-1: C0603X104K5RACAUTO; Manufacturer: Kemet; Part Number: C0603X104K5RACAUTO
C62 = CAP_0805_10UF_25V: CAP, CER, 10.UF, 25V, 10%, X5R, 0805; MFG PART NUM: TMK212BBJ106KG-T; VALENTIUM PART NUM: <VALENTIUM>; MFG NAME: TAIYO YUDEN; MAXTEMP: 85C; MINTEMP: -55C; DESC: CAP, CER, 10.UF, 10V, 10%, X5R, 0805; MODIFY DATE: 10/23/2013; CATEGORY: CAP, CER; Date: 4/11/2006 3:37:28 PM; SHEETPART: *; P1: 10%; P2: 25V; P3: X5R; Size: 0805; Supplier 1: MOUSER; Supplier Part Number 1: 963-TMK212BBJ106KG-T
R10 R11 = CMP-2000-06942-1: Chip Resistor, 4.7 KOhm, +/- 1%, 0.1 W, -55 to 155 degC, 0603 (1608 Metric), RoHS, Tape and Reel RC0603FR-074K7L; Manufacturer: Yageo; Power Rating: 100mW; Temperature Coefficient: 100PPM/C; Resistance: 4.7kOhms; Voltage Rating: 50V; Package Reference: 0603; Series: RC; Datasheet Version: Rev. 7, 05/2017; Packaging: Reel; Termination Style: SMD/SMT; Datasheet URL: http://www.yageo.com/documents/recent/PYu-RC_Group_51_RoHS_L_7.pdf; Manufacturer URL: http://www.yageo.com/; Package Description: 2-Pin Surface Mount Device, Body 1.6 x 0.8 mm; Case Code - mm: 1608; Case Code - in: 0603; Mounting Technology: SurfaceMount; Operating Temperature Range: -55Cto+155C; Tolerance: 1%; Product: ThickFilmResistorsGeneralPurpose
R12 = CMP-2000-03854-1: Part Number: CRCW0603110RFKEA; Manufacturer: Vishay Dale
R45-R47 = CMP-2003-04873-1: Part Number: CRCW12060000Z0EAHP; Manufacturer: Vishay Dale
SKT1-SKT10 = 0332-0-43-80-18-27-10-0: Solder socket for pin headers
U3 = CMP-0058-01000-2: Automotive LVDS Dual Differential Driver, 8-pin Narrow SOIC; Manufacturer: National Semiconductor; PackageTopMarking: NSZXTT*90LV0*27AQM; CompType: Interface IC; PowerWise: N; DatasheetVersion: Oct-2008; PinCount: 8; RevisionNote: Component URLs added; Code_IPC: SOIC127P600-8; ComponentLink1URL: http://www.national.com/ds/DS/DS90LV027AQ.pdf; ComponentLink3Description: M08A Package Page; PackageDescription: SOIC Narrow, 4.9 x 3.9 x 1.45mm, 8 Lead, 1.27mm Pitch; ComponentLink2Description: DS90LV027AQ Web Page; ComponentLink2URL: http://www.national.com/pf/DS/DS90LV027AQ.html; RoHS: Y; Code_JEDEC: MS-012-AA; PackageReference: M08A; PackageVersion: revM, May-2009; ComponentLink1Description: DS90LV027AQ Datasheet; ComponentLink3URL: http://www.national.com/packaging/folders/m08a.html
U4 = CMP-0058-01010-2: Automotive LVDS Dual Differential Line Receiver, 8-pin Narrow SOIC; Manufacturer: National Semiconductor; PowerWise: N; PackageTopMarking: NSZXTT*90LV0*28AQM; CompType: Interface IC; DatasheetVersion: Oct-2008; PackageReference: M08A; RevisionNote: Component URLs added; Code_JEDEC: MS-012-AA; PackageVersion: revM, May-2009; ComponentLink1URL: http://www.national.com/ds/DS/DS90LV028AQ.pdf; PinCount: 8; ComponentLink3Description: M08A Package Page; ComponentLink1Description: DS90LV028AQ Datasheet; Code_IPC: SOIC127P600-8; RoHS: Y; ComponentLink2URL: http://www.national.com/pf/DS/DS90LV028AQ.html; PackageDescription: SOIC Narrow, 4.9 x 3.9 x 1.45mm, 8 Lead, 1.27mm Pitch; ComponentLink2Description: DS90LV028AQ Web Page; ComponentLink3URL: http://www.national.com/packaging/folders/m08a.html
U10 = MAC-SA5X: MOD, MAC, MAC-SA5X, ATOMIC CLOCK; VELENTIUM PART NUM: <V PART NUM>; MFG NAME: MICROCHIP; MAXTEMP: 85C; MINTEMP: -40C; OTHER: AEC-Q200; MODIFY DATE: 3/22/2006 1:36:44 PM; MFG PART NUM: MAC-SA5X; CATEGORY: MOD; P1: ATOMIC CLOCK; SHEETPART: *; DESC: MOD, MAC, MAC-SA5X, ATOMIC CLOCK
J31 = SA53_Header: Supplier 1: Digi-Key
J39-J42 = SA53 Screw: Supplier 1: Digi-Key

## Sheet 07-FPGA.SchDoc
size Tabloid; Customer: 01910; SheetNumber: 7; SheetTotal: 16
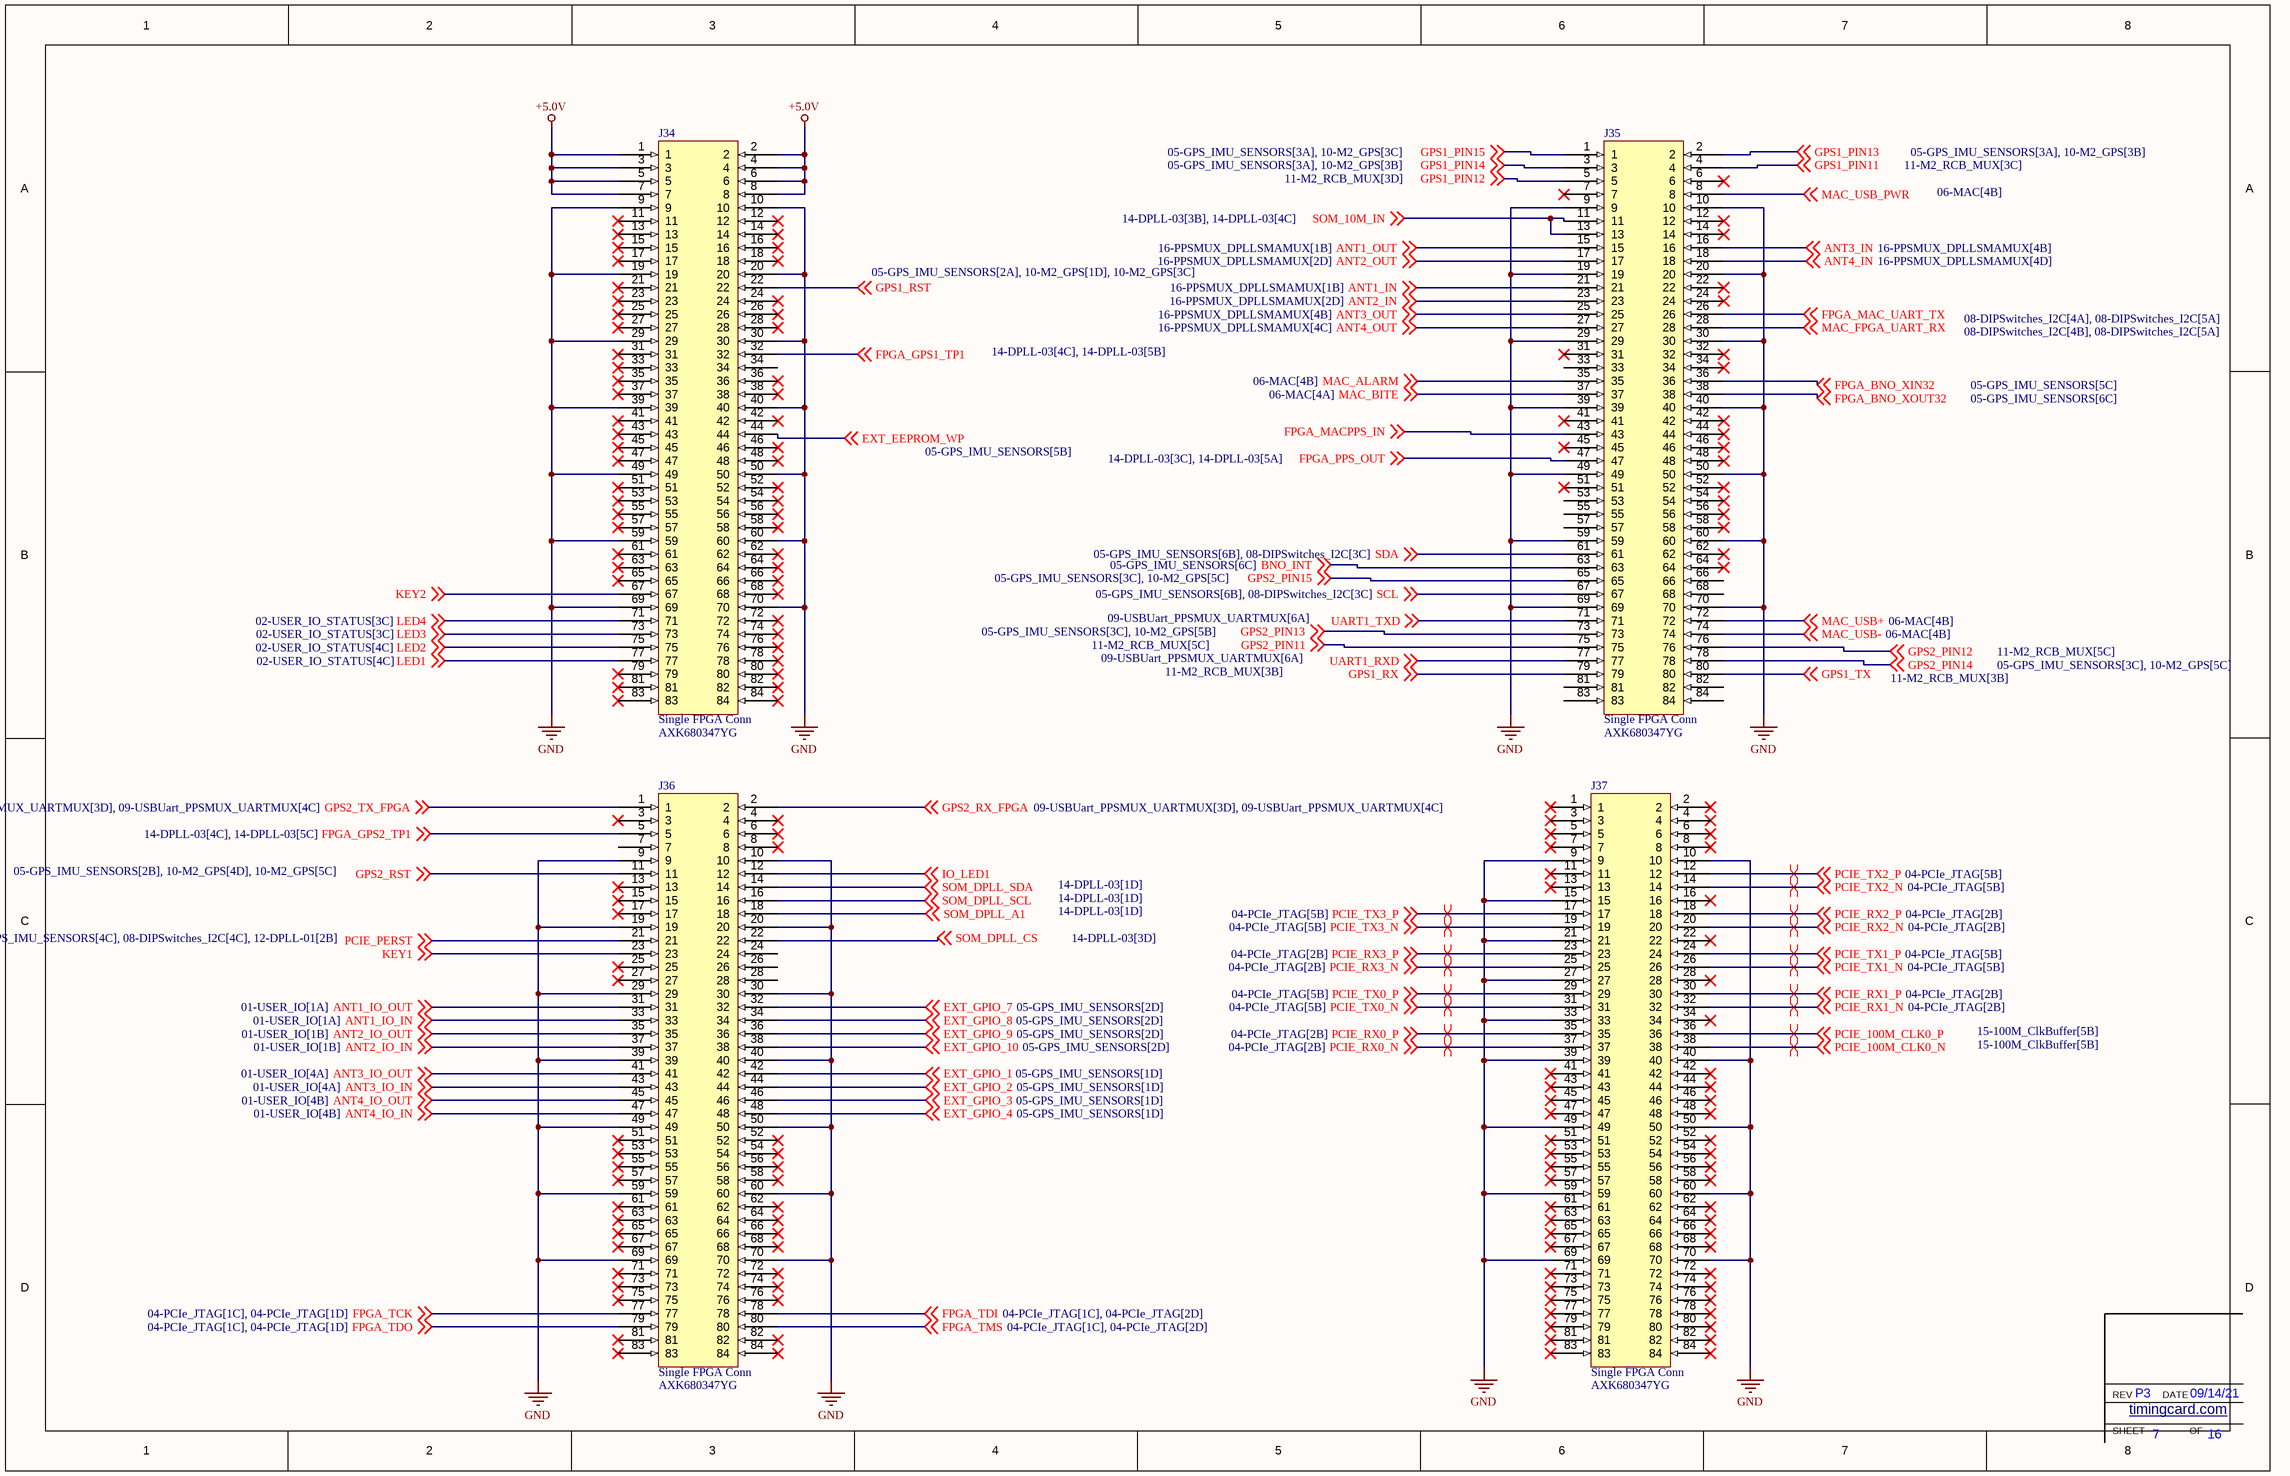
[diagram p7: 07-FPGA.SchDoc]

### Parts
J34  Single FPGA Conn  Part Number: AXK680347YG  [SingleFPGAConn]
J35  Single FPGA Conn  Part Number: AXK680347YG  [SingleFPGAConn]
J36  Single FPGA Conn  Part Number: AXK680347YG  [SingleFPGAConn]
J37  Single FPGA Conn  Part Number: AXK680347YG  [SingleFPGAConn]

### Nets
+5.0V: J34.1 J34.2 J34.3 J34.4 J34.5 J34.6 J34.7 J34.8
GND: J34.9 J34.10 J34.19 J34.20 J34.29 J34.30 J34.39 J34.40 J34.49 J34.50 J34.59 J34.60 J34.69 J34.70 J35.9 J35.10 J35.19 J35.20 J35.29 J35.30 J35.39 J35.40 J35.49 J35.50 J35.59 J35.60 J35.69 J35.70 J36.9 J36.10 J36.19 J36.20 J36.29 J36.30 J36.39 J36.40 J36.49 J36.50 J36.59 J36.60 J36.69 J36.70 J37.9 J37.10 J37.15 J37.21 J37.27 J37.33 J37.39 J37.40 J37.49 J37.50 J37.59 J37.60 J37.69 J37.70
ANT1_IN: J35.21 ; off-sheet ANT1_IN
ANT1_IO_IN: J36.33 ; off-sheet ANT1_IO_IN
ANT1_IO_OUT: J36.31 ; off-sheet ANT1_IO_OUT
ANT1_OUT: J35.15 ; off-sheet ANT1_OUT
ANT2_IN: J35.23 ; off-sheet ANT2_IN
ANT2_IO_IN: J36.37 ; off-sheet ANT2_IO_IN
ANT2_IO_OUT: J36.35 ; off-sheet ANT2_IO_OUT
ANT2_OUT: J35.17 ; off-sheet ANT2_OUT
ANT3_IN: J35.16 ; off-sheet ANT3_IN
ANT3_IO_IN: J36.43 ; off-sheet ANT3_IO_IN
ANT3_IO_OUT: J36.41 ; off-sheet ANT3_IO_OUT
ANT3_OUT: J35.25 ; off-sheet ANT3_OUT
ANT4_IN: J35.18 ; off-sheet ANT4_IN
ANT4_IO_IN: J36.47 ; off-sheet ANT4_IO_IN
ANT4_IO_OUT: J36.45 ; off-sheet ANT4_IO_OUT
ANT4_OUT: J35.27 ; off-sheet ANT4_OUT
BNO_INT: J35.63 ; off-sheet BNO_INT
EXT_EEPROM_WP: J34.44 ; off-sheet EXT_EEPROM_WP
EXT_GPIO_1: J36.42 ; off-sheet EXT_GPIO_1
EXT_GPIO_2: J36.44 ; off-sheet EXT_GPIO_2
EXT_GPIO_3: J36.46 ; off-sheet EXT_GPIO_3
EXT_GPIO_4: J36.48 ; off-sheet EXT_GPIO_4
EXT_GPIO_7: J36.32 ; off-sheet EXT_GPIO_7
EXT_GPIO_8: J36.34 ; off-sheet EXT_GPIO_8
EXT_GPIO_9: J36.36 ; off-sheet EXT_GPIO_9
EXT_GPIO_10: J36.38 ; off-sheet EXT_GPIO_10
FPGA_BNO_XIN32: J35.36 ; off-sheet FPGA_BNO_XIN32
FPGA_BNO_XOUT32: J35.38 ; off-sheet FPGA_BNO_XOUT32
FPGA_GPS1_TP1: J34.32 ; off-sheet FPGA_GPS1_TP1
FPGA_GPS2_TP1: J36.5 ; off-sheet FPGA_GPS2_TP1
FPGA_MAC_UART_TX: J35.26 ; off-sheet FPGA_MAC_UART_TX
FPGA_MACPPS_IN: J35.43 ; off-sheet FPGA_MACPPS_IN
FPGA_PPS_OUT: J35.47 ; off-sheet FPGA_PPS_OUT
FPGA_TCK: J36.77 ; off-sheet FPGA_TCK
FPGA_TDI: J36.78 ; off-sheet FPGA_TDI
FPGA_TDO: J36.79 ; off-sheet FPGA_TDO
FPGA_TMS: J36.80 ; off-sheet FPGA_TMS
GPS1_PIN11: J35.4 ; off-sheet GPS1_PIN11
GPS1_PIN12: J35.5 ; off-sheet GPS1_PIN12
GPS1_PIN13: J35.2 ; off-sheet GPS1_PIN13
GPS1_PIN14: J35.3 ; off-sheet GPS1_PIN14
GPS1_PIN15: J35.1 ; off-sheet GPS1_PIN15
GPS1_RST: J34.22 ; off-sheet GPS1_RST
GPS1_RX: J35.79 ; off-sheet GPS1_RX
GPS1_TX: J35.80 ; off-sheet GPS1_TX
GPS2_PIN11: J35.75 ; off-sheet GPS2_PIN11
GPS2_PIN12: J35.76 ; off-sheet GPS2_PIN12
GPS2_PIN13: J35.73 ; off-sheet GPS2_PIN13
GPS2_PIN14: J35.78 ; off-sheet GPS2_PIN14
GPS2_PIN15: J35.65 ; off-sheet GPS2_PIN15
GPS2_RST: J36.11 ; off-sheet GPS2_RST
GPS2_RX_FPGA: J36.2 ; off-sheet GPS2_RX_FPGA
GPS2_TX_FPGA: J36.1 ; off-sheet GPS2_TX_FPGA
IO_LED1: J36.12 ; off-sheet IO_LED1
KEY1: J36.23 ; off-sheet KEY1
KEY2: J34.67 ; off-sheet KEY2
LED1: J34.77 ; off-sheet LED1
LED2: J34.75 ; off-sheet LED2
LED3: J34.73 ; off-sheet LED3
LED4: J34.71 ; off-sheet LED4
MAC_ALARM: J35.35 ; off-sheet MAC_ALARM
MAC_BITE: J35.37 ; off-sheet MAC_BITE
MAC_FPGA_UART_RX: J35.28 ; off-sheet MAC_FPGA_UART_RX
MAC_USB+: J35.72 ; off-sheet MAC_USB+
MAC_USB-: J35.74 ; off-sheet MAC_USB-
MAC_USB_PWR: J35.8 ; off-sheet MAC_USB_PWR
PCIE_100M_CLK0_N: J37.38 ; off-sheet PCIE_100M_CLK0_N
PCIE_100M_CLK0_P: J37.36 ; off-sheet PCIE_100M_CLK0_P
PCIE_PERST: J36.21 ; off-sheet PCIE_PERST
PCIE_RX0_N: J37.37 ; off-sheet PCIE_RX0_N
PCIE_RX0_P: J37.35 ; off-sheet PCIE_RX0_P
PCIE_RX1_N: J37.32 ; off-sheet PCIE_RX1_N
PCIE_RX1_P: J37.30 ; off-sheet PCIE_RX1_P
PCIE_RX2_N: J37.20 ; off-sheet PCIE_RX2_N
PCIE_RX2_P: J37.18 ; off-sheet PCIE_RX2_P
PCIE_RX3_N: J37.25 ; off-sheet PCIE_RX3_N
PCIE_RX3_P: J37.23 ; off-sheet PCIE_RX3_P
PCIE_TX0_N: J37.31 ; off-sheet PCIE_TX0_N
PCIE_TX0_P: J37.29 ; off-sheet PCIE_TX0_P
PCIE_TX1_N: J37.26 ; off-sheet PCIE_TX1_N
PCIE_TX1_P: J37.24 ; off-sheet PCIE_TX1_P
PCIE_TX2_N: J37.14 ; off-sheet PCIE_TX2_N
PCIE_TX2_P: J37.12 ; off-sheet PCIE_TX2_P
PCIE_TX3_N: J37.19 ; off-sheet PCIE_TX3_N
PCIE_TX3_P: J37.17 ; off-sheet PCIE_TX3_P
SCL: J35.67 ; off-sheet SCL
SDA: J35.61 ; off-sheet SDA
SOM_10M_IN: J35.11 J35.13 ; off-sheet SOM_10M_IN
SOM_DPLL_A1: J36.18 ; off-sheet SOM_DPLL_A1
SOM_DPLL_CS: J36.22 ; off-sheet SOM_DPLL_CS
SOM_DPLL_SCL: J36.16 ; off-sheet SOM_DPLL_SCL
SOM_DPLL_SDA: J36.14 ; off-sheet SOM_DPLL_SDA
UART1_RXD: J35.77 ; off-sheet UART1_RXD
UART1_TXD: J35.71 ; off-sheet UART1_TXD

Not connected (* = marked no-connect by the designer): J34 11* 12* 13* 14* 15* 16* 17* 18* 21* 23* 24* 25* 26* 27* 28* 31* 33* 34 35* 36* 37* 38* 41* 42* 43* 45* 46* 47* 48* 51* 52* 53* 54* 55* 56* 57* 58* 61* 62* 63* 64* 65* 66* 68* 72* 74* 76* 78* 79* 80* 81* 82* 83* 84*; J35 6* 7* 12* 14* 22* 24* 31* 32* 33 34* 41* 42* 44* 45* 46* 48* 51* 52* 53 54* 55 56* 57 58* 62* 64* 66 68 81 82 83 84; J36 3* 4* 6* 7 8* 13* 15* 17* 24 25* 26 27* 28 51* 52* 53* 54* 55* 56* 57* 58* 61* 62* 63* 64* 65* 66* 67* 68* 71* 72* 73* 74* 75* 76* 81* 82* 83* 84*; J37 1* 2* 3* 4* 5* 6* 7* 8* 11* 13* 16* 22* 28* 34* 41* 42* 43* 44* 45* 46* 47* 48* 51* 52* 53* 54* 55* 56* 57* 58* 61* 62* 63* 64* 65* 66* 67* 68* 71* 72* 73* 74* 75* 76* 77* 78* 79* 80* 81* 82* 83* 84*

### Layout directives
differential pair: PCIE_100M_CLK0_N, PCIE_100M_CLK0_P, PCIE_RX0_N, PCIE_RX0_P, PCIE_RX1_N, PCIE_RX1_P, PCIE_RX2_N, PCIE_RX2_P, PCIE_RX3_N, PCIE_RX3_P, PCIE_TX0_N, PCIE_TX0_P, PCIE_TX1_N, PCIE_TX1_P, PCIE_TX2_N, PCIE_TX2_P, PCIE_TX3_N, PCIE_TX3_P

### Notes on the sheet
- SHEET
- REV
- timingcard.com <http://timingcard.com>
- DATE
- OF

### Library data of the parts
J34-J37 = Single FPGA Conn: Supplier 1: Digi-Key; Supplier Part Number 1: 255-3246-1-ND

## Sheet 08-DIPSwitches_I2C.SchDoc
size B; SheetNumber: 8; SheetTotal: 16
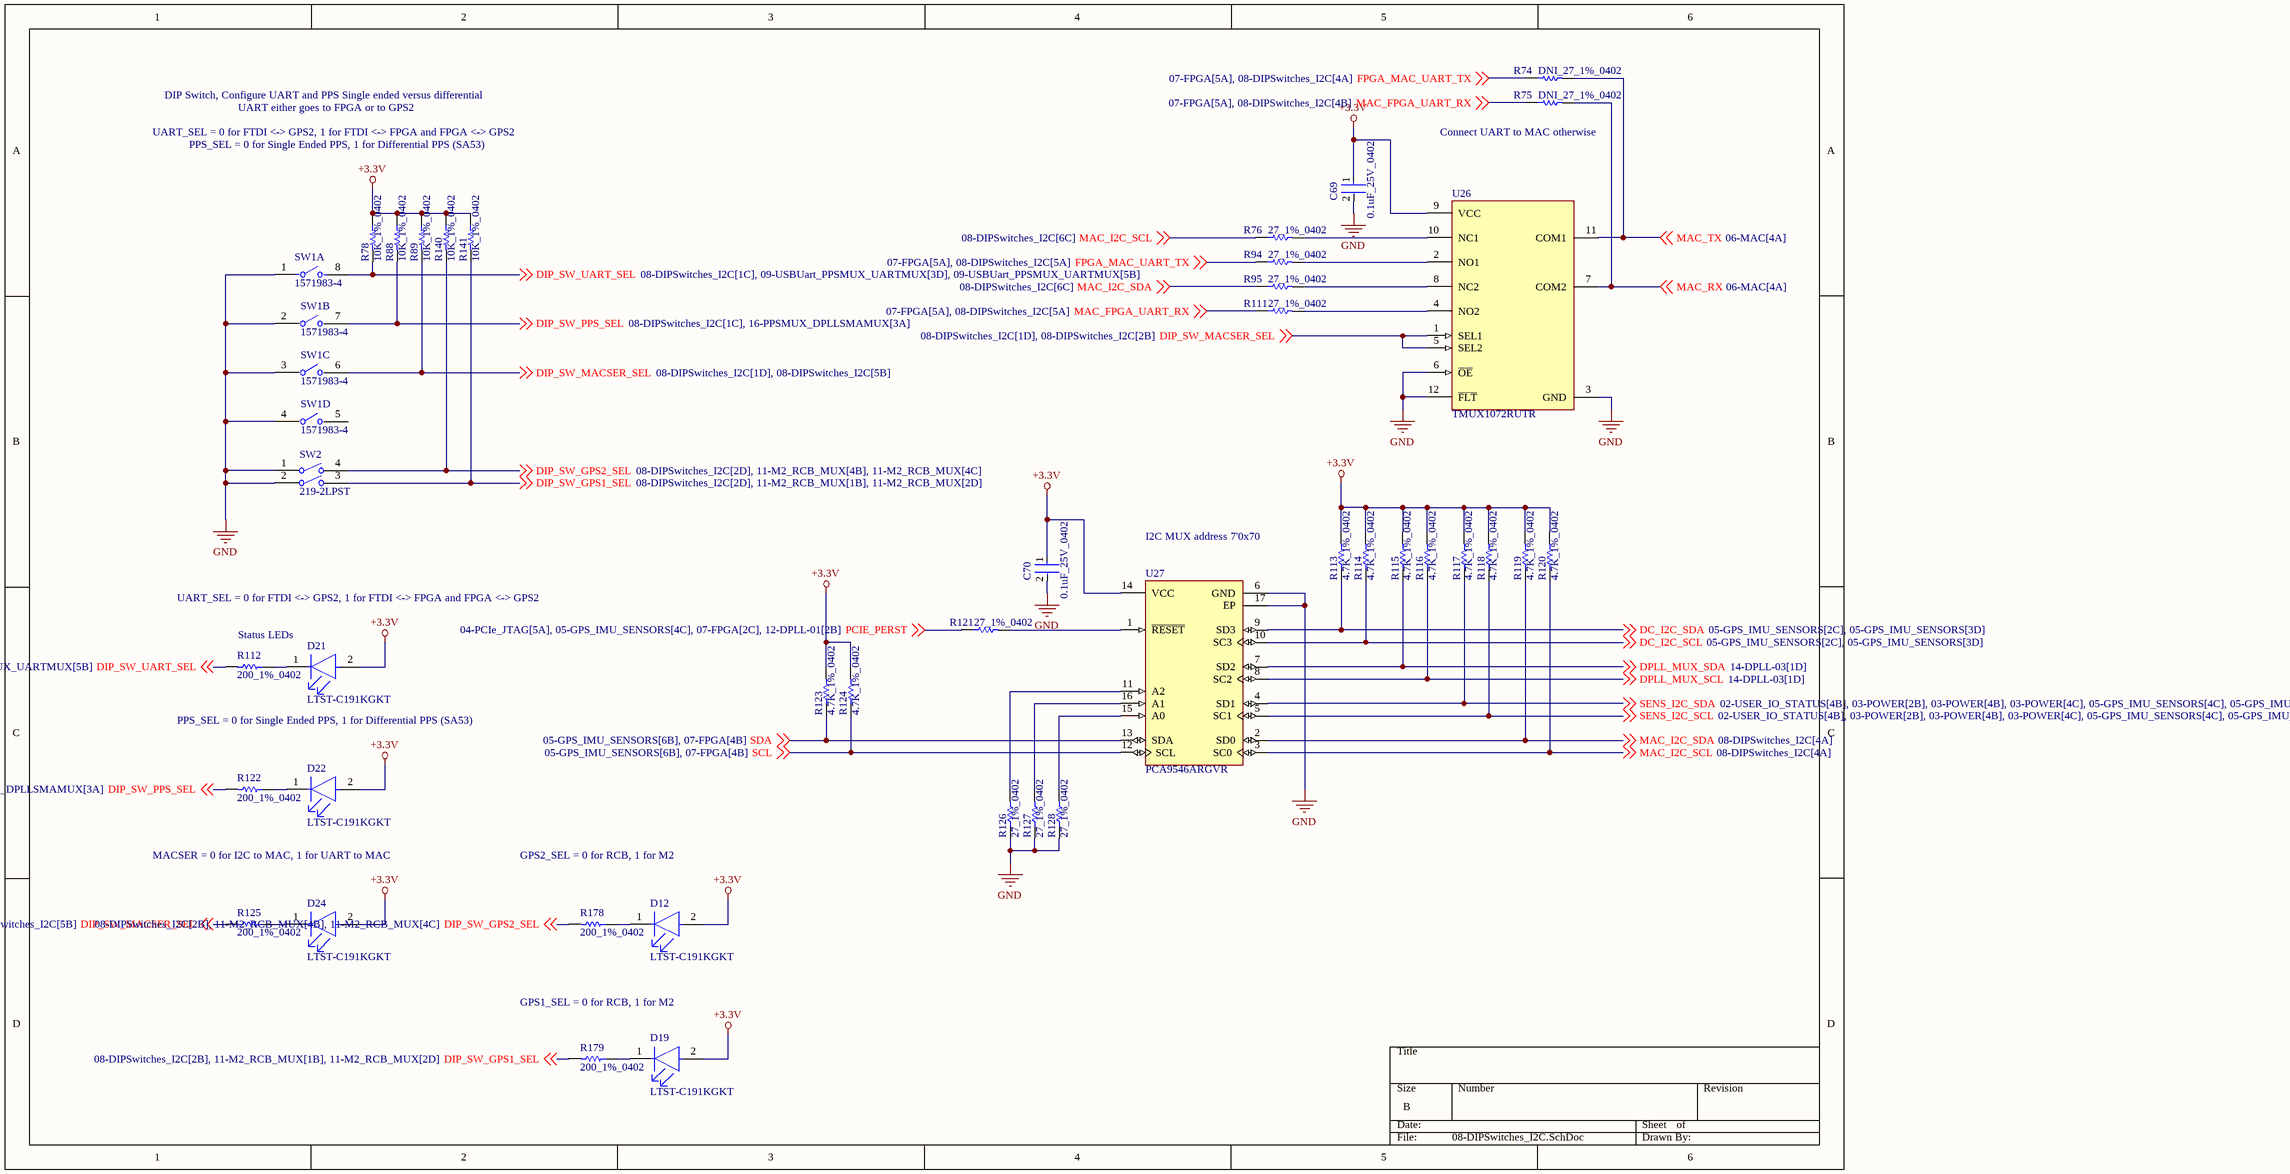
[diagram p8: 08-DIPSwitches_I2C.SchDoc]

### Parts
C69  0.1uF_25V_0402  [FP-0402-L_1_0_1-W_0_5_0_1-IPC_C]
C70  0.1uF_25V_0402  [FP-0402-L_1_0_1-W_0_5_0_1-IPC_C]
D12  LTST-C191KGKT  [FP-LTST-C191KGKT-MFG]
D19  LTST-C191KGKT  [FP-LTST-C191KGKT-MFG]
D21  LTST-C191KGKT  [FP-LTST-C191KGKT-MFG]
D22  LTST-C191KGKT  [FP-LTST-C191KGKT-MFG]
D24  LTST-C191KGKT  [FP-LTST-C191KGKT-MFG]
R74  DNI_27_1%_0402  [RESC1005X40X25NL05T05]  (no BOM)
R75  DNI_27_1%_0402  [RESC1005X40X25NL05T05]  (no BOM)
R76  27_1%_0402  [RESC1005X40X25NL05T05]
R78  10K_1%_0402  [RESC1005X40X25LL05T10]
R88  10K_1%_0402  [RESC1005X40X25LL05T10]
R89  10K_1%_0402  [RESC1005X40X25LL05T10]
R94  27_1%_0402  [RESC1005X40X25NL05T05]
R95  27_1%_0402  [RESC1005X40X25NL05T05]
R111  27_1%_0402  [RESC1005X40X25NL05T05]
R112  200_1%_0402  [RESC1005X40X25NL05T05]
R113  4.7K_1%_0402  [RESC1005X40X25NL10T10]
R114  4.7K_1%_0402  [RESC1005X40X25NL10T10]
R115  4.7K_1%_0402  [RESC1005X40X25NL10T10]
R116  4.7K_1%_0402  [RESC1005X40X25NL10T10]
R117  4.7K_1%_0402  [RESC1005X40X25NL10T10]
R118  4.7K_1%_0402  [RESC1005X40X25NL10T10]
R119  4.7K_1%_0402  [RESC1005X40X25NL10T10]
R120  4.7K_1%_0402  [RESC1005X40X25NL10T10]
R121  27_1%_0402  [RESC1005X40X25NL05T05]
R122  200_1%_0402  [RESC1005X40X25NL05T05]
R123  4.7K_1%_0402  [RESC1005X40X25NL10T10]
R124  4.7K_1%_0402  [RESC1005X40X25NL10T10]
R125  200_1%_0402  [RESC1005X40X25NL05T05]
R126  27_1%_0402  [RESC1005X40X25NL05T05]
R127  27_1%_0402  [RESC1005X40X25NL05T05]
R128  27_1%_0402  [RESC1005X40X25NL05T05]
R140  10K_1%_0402  [RESC1005X40X25LL05T10]
R141  10K_1%_0402  [RESC1005X40X25LL05T10]
R178  200_1%_0402  [RESC1005X40X25NL05T05]
R179  200_1%_0402  [RESC1005X40X25NL05T05]
SW1  1571983-4  [FP-1571983-4-MFG]  (parts A,B,C,D of 4)
SW2  219-2LPST  [CTS-219-2LPST_V]
U26  TMUX1072RUTR  [FP-RUT0012A-MFG]
U27  PCA9546ARGVR  [RGV0016A_V]

### Nets
+3.3V: C69.1 C70.1 D12.2(A) D19.2(A) D21.2(A) D22.2(A) D24.2(A) R78.1 R88.1 R89.1 R113.2 R114.2 R115.2 R116.2 R117.2 R118.2 R119.2 R120.2 R123.2 R124.2 R140.1 R141.1 U26.9(VCC) U27.14(VCC)
GND: C69.2 C70.2 R126.1 R127.1 R128.1 SW1.1 SW1.2 SW1.3 SW1.4 SW2.1 SW2.2 U26.3(GND) U26.6(~{OE}) U26.12(~{FLT}) U27.6(GND) U27.17(EP)
DC_I2C_SCL: R114.1 U27.10(SC3) ; off-sheet DC_I2C_SCL
DC_I2C_SDA: R113.1 U27.9(SD3) ; off-sheet DC_I2C_SDA
DIP_SW_GPS1_SEL: R141.2 R179.2 SW2.3 ; off-sheet DIP_SW_GPS1_SEL
DIP_SW_GPS2_SEL: R140.2 R178.2 SW2.4 ; off-sheet DIP_SW_GPS2_SEL
DIP_SW_MACSER_SEL: R89.2 R125.2 SW1.6 U26.1(SEL1) U26.5(SEL2) ; off-sheet DIP_SW_MACSER_SEL
DIP_SW_PPS_SEL: R88.2 R122.2 SW1.7 ; off-sheet DIP_SW_PPS_SEL
DIP_SW_UART_SEL: R78.2 R112.2 SW1.8 ; off-sheet DIP_SW_UART_SEL
DPLL_MUX_SCL: R116.1 U27.8(SC2) ; off-sheet DPLL_MUX_SCL
DPLL_MUX_SDA: R115.1 U27.7(SD2) ; off-sheet DPLL_MUX_SDA
FPGA_MAC_UART_TX: R74.1 R94.1 ; off-sheet FPGA_MAC_UART_TX
MAC_FPGA_UART_RX: R75.1 R111.1 ; off-sheet MAC_FPGA_UART_RX
MAC_I2C_SCL: R76.1 R120.1 U27.3(SC0) ; off-sheet MAC_I2C_SCL
MAC_I2C_SDA: R95.1 R119.1 U27.2(SD0) ; off-sheet MAC_I2C_SDA
MAC_RX: R75.2 U26.7(COM2) ; off-sheet MAC_RX
MAC_TX: R74.2 U26.11(COM1) ; off-sheet MAC_TX
PCIE_PERST: R121.1 ; off-sheet PCIE_PERST
SCL: R124.1 U27.12(SCL) ; off-sheet SCL
SDA: R123.1 U27.13(SDA) ; off-sheet SDA
SENS_I2C_SCL: R118.1 U27.5(SC1) ; off-sheet SENS_I2C_SCL
SENS_I2C_SDA: R117.1 U27.4(SD1) ; off-sheet SENS_I2C_SDA
NetD12_1: D12.1(C) R178.1
NetD19_1: D19.1(C) R179.1
NetD21_1: D21.1(C) R112.1
NetD22_1: D22.1(C) R122.1
NetD24_1: D24.1(C) R125.1
NetR76_2: R76.2 U26.10(NC1)
NetR94_2: R94.2 U26.2(NO1)
NetR95_2: R95.2 U26.8(NC2)
NetR111_2: R111.2 U26.4(NO2)
NetR121_2: R121.2 U27.1(~{RESET})
NetR126_2: R126.2 U27.11(A2)
NetR127_2: R127.2 U27.16(A1)
NetR128_2: R128.2 U27.15(A0)

Not connected (* = marked no-connect by the designer): SW1 5

### Notes on the sheet
- UART_SEL = 0 for FTDI <-> GPS2, 1 for FTDI <-> FPGA and FPGA <-> GPS2
- DIP Switch, Configure UART and PPS Single ended versus differential
- PPS_SEL = 0 for Single Ended PPS, 1 for Differential PPS (SA53)
- UART either goes to FPGA or to GPS2
- (near R75) Connect UART to MAC otherwise
- I2C MUX address 7'0x70
- Status LEDs
- MACSER = 0 for I2C to MAC, 1 for UART to MAC
- GPS2_SEL = 0 for RCB, 1 for M2
- GPS1_SEL = 0 for RCB, 1 for M2

### Library data of the parts
C69 C70 = CMP-2008-02519-2: General Purpose Ceramic Capacitor, 0402, 100nF, 10%, X7R, 15%, 25V; Package Quantity: 1; Capacitance: 100nF; Min Operating Temperature: -55°C; Voltage: 25V; Voltage Rating: 25V; Construction: Flat; Max Operating Temperature: 125°C; Radiation Hardening: No; Depth: 0.5mm; Thickness: 0.022inch; Voltage Rating (DC): 25V; Number of Pins: 2; Lead Free: Lead Free; Series: -; REACH SVHC: No SVHC; Length: 1mm; Dielectric: X7R; RoHS Compliant: Yes; Mount: Surface Mount; Packaging: Tape and Reel; Case/Package: 0402; Case Code (Imperial): 0402; Termination: SMD/SMT; Width: 0.02inch; Case Code (Metric): 1005; Tolerance: 10%
D12 D19 D21 D22 D24 = CMP-2000-05198-2: LED GREEN CLEAR SMD; Max Power Dissipation: 75mW; Forward Current: 30mA; Reverse Voltage: 5V; Lens Color: Colorless; Forward Voltage: 2V; Dominant Wavelength: 571nm; Number of LEDs: 1; Viewing Angle: 130°; Lens Style: Rectangular; Test Current: 20mA; Luminous Intensity: 35mcd; Wavelength: 574nm; Width: 0.8mm; Case Code (Imperial): 0603; Number of Pins: 2; Lead Free: Lead Free; Packaging: Tape and Reel; Package Quantity: 1; Min Operating Temperature: -55°C; Case/Package: 0603; Length: 1.6mm; Power Dissipation: 75mW; Depth: 0.8mm; Radiation Hardening: No; Mount: Surface Mount; Max Operating Temperature: 85°C; Color: Green; Power Rating: 75mW; Height: 0.55mm; Illumination Color: Green; Case Code (Metric): 1608; Lens Transparency: Clear; Number of Elements: 1
R74-R76 R94 R95 R111 R121 R126-R128 = CMP-2002-08434-1: Part Number: CRCW040227R0FKED; Manufacturer: Vishay Dale
R78 R88 R89 R140 R141 = CMP-2002-07353-1: Part Number: RC0402FR-0710KL; Manufacturer: Yageo / Phycomp
R112 R122 R125 R178 R179 = CMP-2002-08352-1: Manufacturer: Vishay Dale; Part Number: CRCW0402200RFKTD
R113-R120 R123 R124 = CMP-2002-05217-1: Manufacturer: Bourns; Part Number: CR0402-FX-4701GLF
SW1 = CMP-03400-000014-1: SWITCH SLIDE DIP SPST 25MA 24V; Manufacturer: TE Connectivity; Standoff Height: 0.1mm; Electromechanical Life: 1000Cycles; Number Of Circuits: 4; Contact Resistance: 100mΩ; ComponentLink2URL: https://www.te.com/commerce/DocumentDelivery/DDEController?Action=showdoc&DocId=Customer+Drawing%7F1571983%7FC6%7Fpdf%7FEnglish%7FENG_CD_1571983_C6.pdf%7F1571983-4; Throw Configuration: SPST; Device Class L1: Electromechanical; Lead Free: Yes; Temperature Range Low: -30°C; Temperature: -30°C to +85°C; Octopart: https://octopart.com/1571983-4-te+connectivity-46507521; Temperature Range High: +85°C; Package: 1571983-4; Height: 2.56mm; Manufacturer Part Number: 1571983-4; Contact Current Rating: 25mA; ComponentLink2Description: Datasheet; Device Class L3: DIP Switches; Category: Switch; Device Class L2: Switches; RoHS: TRUE; Voltage Rating Dc: 24V; Digikey Description: SWITCH SLIDE DIP SPST 25MA 24V; Automotive: No
SW2 = CMP-2000-05532-1: Surface Mount DIP Switch Auto Placeable, -55 to 85 degC, 4-Pin SMD, RoHS, Tube; Manufacturer: CTS Corporation; Sealed Option: Sealed; Circuitry: SPST; No of Positions: 2; Actuator Style: LowProfile; Type: Dip; Package Reference: 219-2LPST; Mounting Technology: SurfaceMount; Datasheet Version: 12/2008; Package Description: 4-Pin Surface Mount Device, Body 6.7 x 6.55 mm; Datasheet URL: http://www.ctscorp.com/wp-content/uploads/2016/01/219-Dec-30-2008.pdf; Termination Style: GullWing; Manufacturer URL: http://www.ctscorp.com/
U26 = CMP-04892-000114-1: IC SWITCH SPDT DUAL 12UQFN; Number of Circuits: 2; -3db Bandwidth: 1.2GHz; On-State Resistance: 18R; Number of Pins: 12; Min Operating Temperature: -40°C; RoHS Compliant: Yes; Max Operating Temperature: 125°C; Number of Channels: 2; Packaging: Tape and Reel
U27 = CMP-0314-00065-2: 4-Channel I2C and SMBus Multiplexer with Reset Functions, 2.3 to 5.5 V, -40 to 85 degC, 16-pin VQFN (RGV), Green (RoHS & no Sb/Br); Manufacturer: Texas Instruments; fSCLK(Max)(MHz): 100, 400; I2C Address: 1110 xxx; VCC(Min)(V): 2.3; 5V Tolerant I/O: Yes; Channel Width: 4; VCC(Max)(V): 5.5; tpd max(ns): 0.3, 1; Simultaneously Active Channels: 1 to 4; Max Frequency(kHz): 400; SubFamily: I2C Multiplexer, Switch; Mounting Technology: Surface Mount; ComponentLink2Description: Package Specification; DatasheetVersion: SCPS148E; PackageDescription: 16-Pin Plastic Quad Flat No-Lead, 4 x 4 mm Body, 0.65 mm Pitch, 2.16 x 2.16 mm Exposed Pad; PackageVersion: revF, Jun-2011; ComponentLink1URL: http://www.ti.com/general/docs/lit/getliterature.tsp?genericPartNumber=PCA9546A&fileType=pdf; Eco-Plan: Green (RoHS & no Sb/Br); Reset Input: Yes; Vcc range(V): 2.3 to 5.5; ComponentLink2URL: http://www.ti.com/litv/pdf/mpds178g; Open Drain I/O Type: Yes; PackageReference: RGV0016A; PartNumber: PCA9546ARGVR; ComponentLink1Description: Datasheet